# EAGLE design Tapestry (EAGLE 7.3.0)
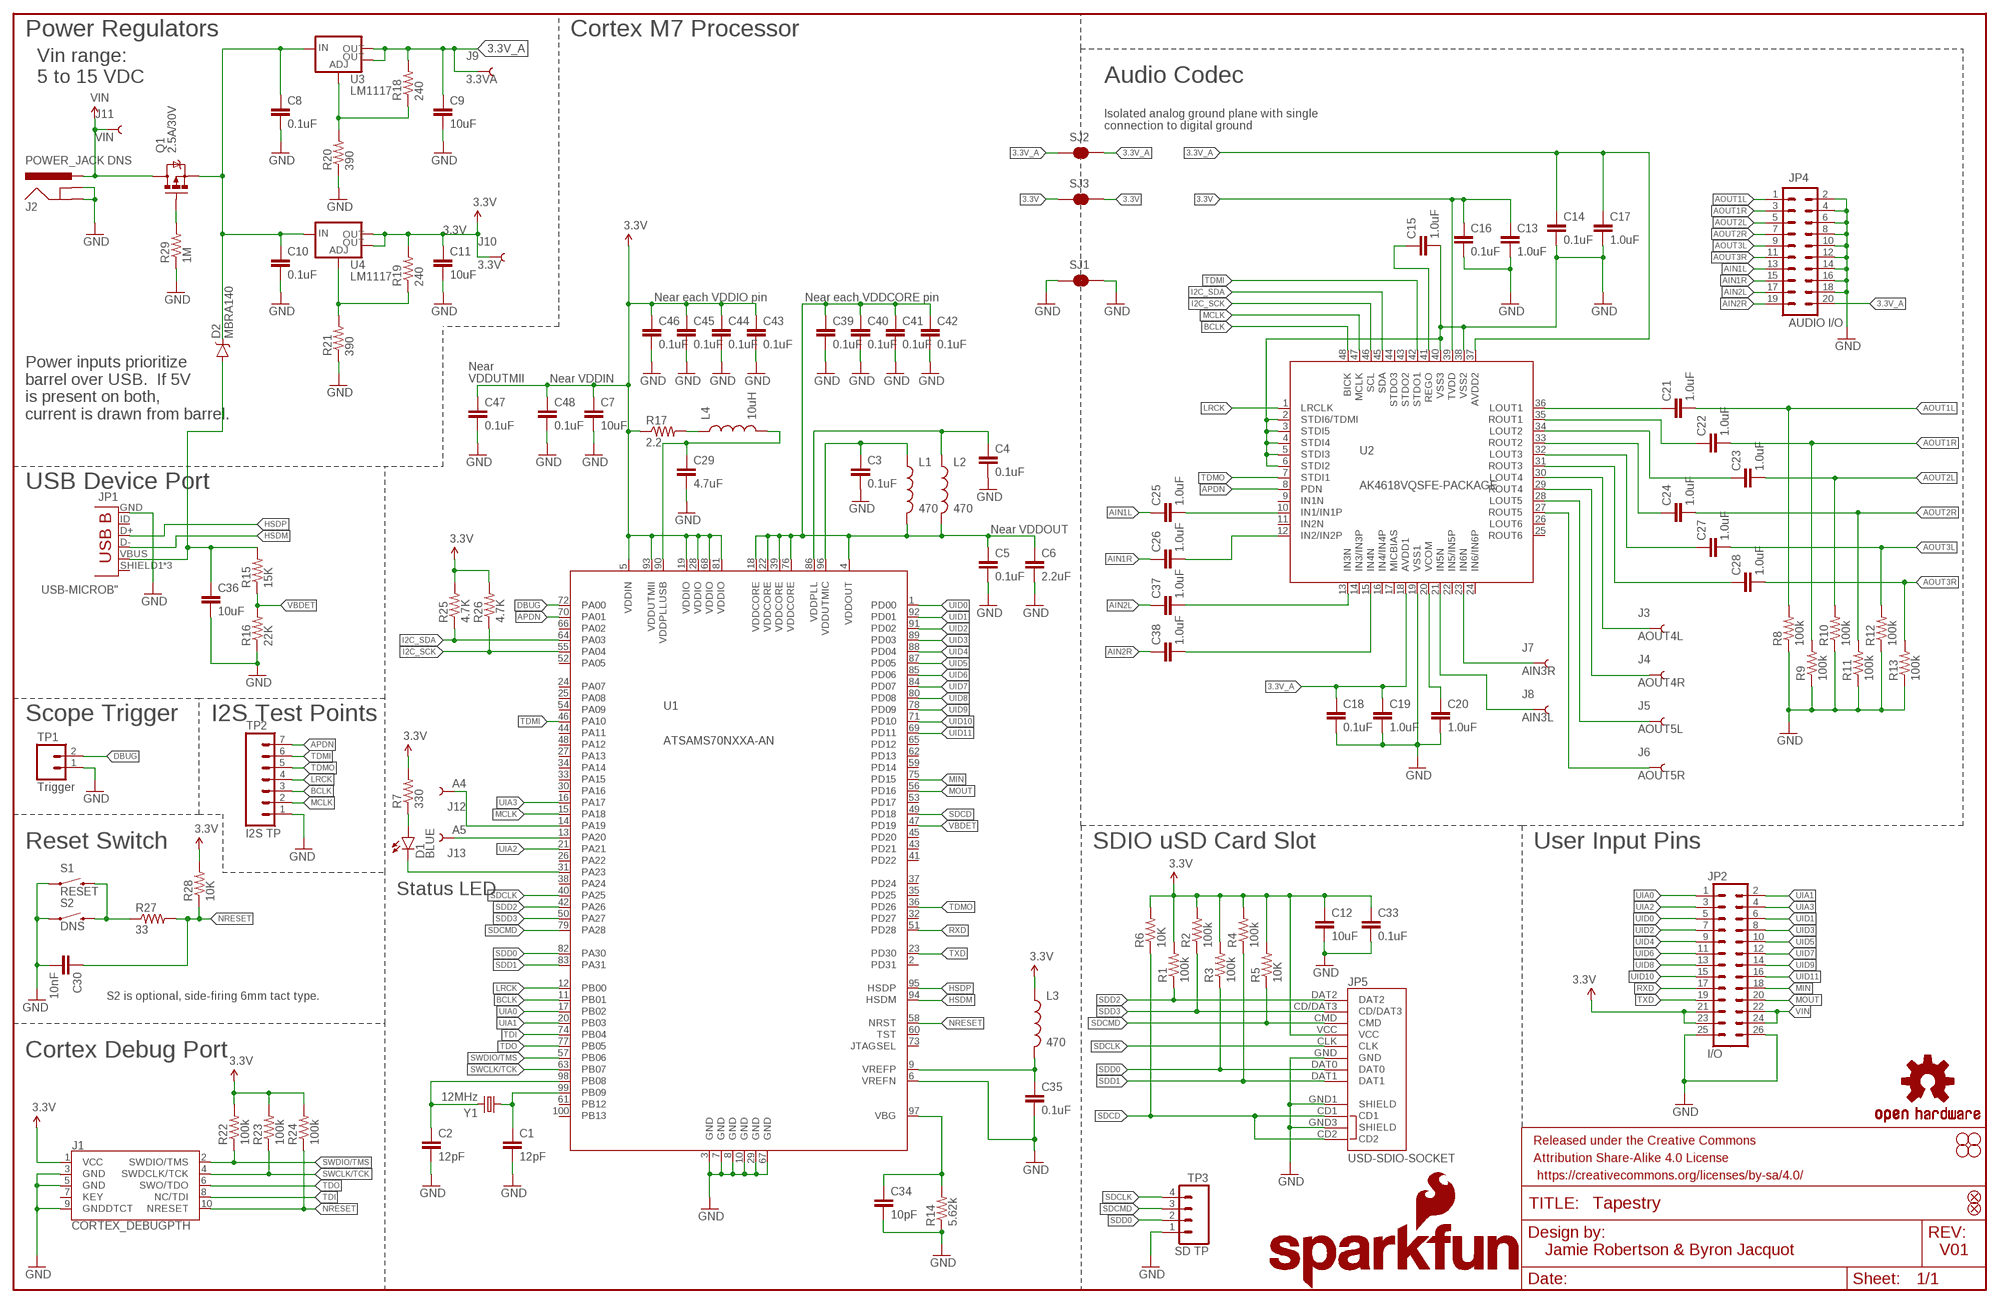
[diagram p0: schematic, sheet 1]

## Parts
C1  12pF  12PF-50V-5%(0603)  [0603-CAP]
C2  12pF  12PF-50V-5%(0603)  [0603-CAP]
C3  0.1uF  0.1UF-25V(+80/-20%)(0603)  [0603-CAP]
C4  0.1uF  0.1UF-25V(+80/-20%)(0603)  [0603-CAP]
C5  0.1uF  0.1UF-25V(+80/-20%)(0603)  [0603-CAP]
C6  2.2uF  2.2UF-10V-20%(0603)  [0603-CAP]
C7  10uF  10UF-6.3V-20%(0603)  [0603-CAP]
C8  0.1uF  0.1UF-25V(+80/-20%)(0603)  [0603-CAP]
C9  10uF  10UF-6.3V-20%(0603)  [0603-CAP]
C10  0.1uF  0.1UF-25V(+80/-20%)(0603)  [0603-CAP]
C11  10uF  10UF-6.3V-20%(0603)  [0603-CAP]
C12  10uF  10UF-6.3V-20%(0603)  [0603-CAP]
C13  1.0uF  1.0UF-16V-10%(0603)  [0603-CAP]
C14  0.1uF  0.1UF-25V(+80/-20%)(0603)  [0603-CAP]
C15  1.0uF  1.0UF-16V-10%(0603)  [0603-CAP]
C16  0.1uF  0.1UF-25V(+80/-20%)(0603)  [0603-CAP]
C17  1.0uF  1.0UF-16V-10%(0603)  [0603-CAP]
C18  0.1uF  0.1UF-25V(+80/-20%)(0603)  [0603-CAP]
C19  1.0uF  1.0UF-16V-10%(0603)  [0603-CAP]
C20  1.0uF  1.0UF-16V-10%(0603)  [0603-CAP]
C21  1.0uF  1.0UF-16V-10%(0603)  [0603-CAP]
C22  1.0uF  1.0UF-16V-10%(0603)  [0603-CAP]
C23  1.0uF  1.0UF-16V-10%(0603)  [0603-CAP]
C24  1.0uF  1.0UF-16V-10%(0603)  [0603-CAP]
C25  1.0uF  1.0UF-16V-10%(0603)  [0603-CAP]
C26  1.0uF  1.0UF-16V-10%(0603)  [0603-CAP]
C27  1.0uF  1.0UF-16V-10%(0603)  [0603-CAP]
C28  1.0uF  1.0UF-16V-10%(0603)  [0603-CAP]
C29  4.7uF  4.7UF-6.3V-10%(0603)0603  [0603-CAP]
C30  10nF  10NF/10000PF-50V-10%(0603)  [0603-CAP]
C33  0.1uF  0.1UF-25V(+80/-20%)(0603)  [0603-CAP]
C34  10pF  10PF-50V-5%(0603)  [0603-CAP]
C35  0.1uF  0.1UF-25V(+80/-20%)(0603)  [0603-CAP]
C36  10uF  10UF-6.3V-20%(0603)  [0603-CAP]
C37  1.0uF  1.0UF-16V-10%(0603)  [0603-CAP]
C38  1.0uF  1.0UF-16V-10%(0603)  [0603-CAP]
C39  0.1uF  0.1UF-25V(+80/-20%)(0603)  [0603-CAP]
C40  0.1uF  0.1UF-25V(+80/-20%)(0603)  [0603-CAP]
C41  0.1uF  0.1UF-25V(+80/-20%)(0603)  [0603-CAP]
C42  0.1uF  0.1UF-25V(+80/-20%)(0603)  [0603-CAP]
C43  0.1uF  0.1UF-25V(+80/-20%)(0603)  [0603-CAP]
C44  0.1uF  0.1UF-25V(+80/-20%)(0603)  [0603-CAP]
C45  0.1uF  0.1UF-25V(+80/-20%)(0603)  [0603-CAP]
C46  0.1uF  0.1UF-25V(+80/-20%)(0603)  [0603-CAP]
C47  0.1uF  0.1UF-25V(+80/-20%)(0603)  [0603-CAP]
C48  0.1uF  0.1UF-25V(+80/-20%)(0603)  [0603-CAP]
D1  BLUE  LED-BLUE0603  [LED-0603]
D2  MBRA140  DIODE-SCHOTTKY-MBRA140  [SMA-DIODE]
FD1  FIDUCIALUFIDUCIAL  [MICRO-FIDUCIAL]
FD2  FIDUCIALUFIDUCIAL  [MICRO-FIDUCIAL]
FRAME1  FRAME-LEDGER  [CREATIVE_COMMONS]
J1  CORTEX_DEBUGPTH  [2X5-PTH-1.27MM]
J2  POWER_JACK DNS  POWER_JACKPTH_LOCK  [POWER_JACK_PTH_LOCK]
J3  AOUT4L  TEST-POINTTP_15TH_THRU  [TP_15TH]
J4  AOUT4R  TEST-POINTTP_15TH_THRU  [TP_15TH]
J5  AOUT5L  TEST-POINTTP_15TH_THRU  [TP_15TH]
J6  AOUT5R  TEST-POINTTP_15TH_THRU  [TP_15TH]
J7  AIN3R  TEST-POINTTP_15TH_THRU  [TP_15TH]
J8  AIN3L  TEST-POINTTP_15TH_THRU  [TP_15TH]
J9  3.3VA  TEST-POINTTP_15TH_THRU  [TP_15TH]
J10  3.3V  TEST-POINTTP_15TH_THRU  [TP_15TH]
J11  VIN  TEST-POINTTP_15TH_THRU  [TP_15TH]
J12  A4  TEST-POINTTP_15TH_THRU  [TP_15TH]
J13  A5  TEST-POINTTP_15TH_THRU  [TP_15TH]
JP1  USB-MICROB"  [USB-B-MICRO-SMD_V03]
JP2  I/O  M13X22X13  [2X13]
JP4  AUDIO I/O  M10X2  [2X10]
JP5  USD-SDIO-SOCKET  [MICRO-SD-SOCKET-SDIO]
L1  470  INDUCTOR0603  [0603]
L2  470  INDUCTOR0603  [0603]
L3  470  INDUCTOR0603  [0603]
L4  10uH  INDUCTOR0805  [0805]
LOGO1  SFE_LOGO_NAME_FLAME.2_INCH  [SFE_LOGO_NAME_FLAME_.2]
LOGO2  OSHW-LOGOM  [OSHW-LOGO-M]
LOGO3  SFE_LOGO_NAME.2_INCH  [SFE_LOGO_NAME_.2]
Q1  2.5A/30V  MOSFET-PCHANNELDMG2307L  [SOT23-3]
R1  100k  100KOHM-1/10W-1%(0603)  [0603-RES]
R2  100k  100KOHM-1/10W-1%(0603)  [0603-RES]
R3  100k  100KOHM-1/10W-1%(0603)  [0603-RES]
R4  100k  100KOHM-1/10W-1%(0603)  [0603-RES]
R5  10K  10KOHM-1/10W-1%(0603)0603  [0603-RES]
R6  10K  10KOHM-1/10W-1%(0603)0603  [0603-RES]
R7  330  330OHM1/10W1%(0603)  [0603-RES]
R8  100k  100KOHM-1/10W-1%(0603)  [0603-RES]
R9  100k  100KOHM-1/10W-1%(0603)  [0603-RES]
R10  100k  100KOHM-1/10W-1%(0603)  [0603-RES]
R11  100k  100KOHM-1/10W-1%(0603)  [0603-RES]
R12  100k  100KOHM-1/10W-1%(0603)  [0603-RES]
R13  100k  100KOHM-1/10W-1%(0603)  [0603-RES]
R14  5.62k  5.62KOHM1/10W1%(0603)  [0603-RES]
R15  15K  15KOHM1/10W1%(0603)0603  [0603-RES]
R16  22K  22KOHM1/10W1%(0603)  [0603-RES]
R17  2.2  2.2OHM-1/10W-5%(0603)  [0603-RES]
R18  240  240OHM1/10W1%(0603)  [0603-RES]
R19  240  240OHM1/10W1%(0603)  [0603-RES]
R20  390  390OHM1/10W1%(0603)  [0603-RES]
R21  390  390OHM1/10W1%(0603)  [0603-RES]
R22  100k  100KOHM-1/10W-1%(0603)  [0603-RES]
R23  100k  100KOHM-1/10W-1%(0603)  [0603-RES]
R24  100k  100KOHM-1/10W-1%(0603)  [0603-RES]
R25  4.7K  4.7KOHM-1/10W-1%(0603)  [0603-RES]
R26  4.7K  4.7KOHM-1/10W-1%(0603)  [0603-RES]
R27  33  33OHM1/10W1%(0603)  [0603-RES]
R28  10K  10KOHM-1/10W-1%(0603)0603  [0603-RES]
R29  1M  1MOHM-1/10W-1%(0603)  [0603-RES]
S1  RESET  SWITCH-MOMENTARY-2SMD  [TACTILE-SWITCH-SMD]
S2  DNS  SWITCH-MOMENTARY-2SIDE_EZ  [TACTILE-PTH-SIDEEZ]
SJ1  JUMPER-PAD-2-NC_BY_TRACE  [PAD-JUMPER-2-NC_BY_TRACE_YES_SILK]
SJ2  JUMPER-PAD-2-NC_BY_TRACE  [PAD-JUMPER-2-NC_BY_TRACE_YES_SILK]
SJ3  JUMPER-PAD-2-NC_BY_TRACE  [PAD-JUMPER-2-NC_BY_TRACE_YES_SILK]
STANDOFF1  STAND-OFF  [STAND-OFF]
STANDOFF2  STAND-OFF  [STAND-OFF]
STANDOFF3  STAND-OFF  [STAND-OFF]
STANDOFF4  STAND-OFF  [STAND-OFF]
TP1  Trigger  M021X02_NO_SILK  [1X02_NO_SILK]
TP2  I2S TP  M07NO_SILK  [1X07_NO_SILK]
TP3  SD TP  M041X04_NO_SILK  [1X04_NO_SILK]
U1  ATSAMS70NXXA-AN  [LQFP100]
U2  AK4618VQSFE-PACKAGE  [LQFP-48]
U3  LM1117  V_REG_LM1117SOT223  [SOT223]
U4  LM1117  V_REG_LM1117SOT223  [SOT223]
Y1  12MHz  CRYSTALCRYSTAL-SMD-5X3-12MHZ  [CRYSTAL-SMD-5X3]

## Nets
3.3V: C7.1 C11.1 C12.1 C13.1 C16.1 C33.1 C43.1 C44.1 C45.1 C46.1 C47.1 C48.1 J1.1(VCC) J10.P$1 JP2.21 JP2.23 JP5.VCC L3.1 R1.2 R2.2 R3.2 R4.2 R5.2 R6.2 R7.2 R17.1 R19.2 R22.2 R23.2 R24.2 R25.2 R26.2 R28.2 SJ3.1 SJ3.2 U1.5(VDDIN) U1.19(VDDIO) U1.28(VDDIO) U1.68(VDDIO) U1.81(VDDIO) U1.93(VDDUTMII) U2.39(TVDD) U4.2(OUT) U4.4(OUT)
3.3V_A: C9.1 C14.1 C17.1 C18.1 C19.1 J9.P$1 JP4.20 R18.2 SJ2.1 SJ2.2 U2.18(AVDD1) U2.37(AVDD2) U3.2(OUT) U3.4(OUT)
AIN1L: C25.1 JP4.13
AIN1R: C26.1 JP4.15
AIN2L: C37.1 JP4.17
AIN2R: C38.1 JP4.19
AOUT1L: C21.2 JP4.1 R8.2
AOUT1R: C22.2 JP4.3 R9.2
AOUT2L: C23.2 JP4.5 R10.2
AOUT2R: C24.2 JP4.7 R11.2
AOUT3L: C27.2 JP4.9 R12.2
AOUT3R: C28.2 JP4.11 R13.2
APDN: TP2.7 U1.70(PA01) U2.8(PDN)
BCLK: TP2.3 U1.11(PB01) U2.48(BICK)
DBUG: TP1.2 U1.72(PA00)
GND: C1.2 C2.2 C3.2 C4.2 C5.2 C6.2 C7.2 C8.2 C9.2 C10.2 C11.2 C12.2 C13.2 C14.2 C15.2 C16.2 C17.2 C18.2 C19.2 C20.2 C29.2 C30.2 C33.2 C34.2 C35.2 C36.2 C39.2 C40.2 C41.2 C42.2 C43.2 C44.2 C45.2 C46.2 C47.2 C48.2 J1.3(GND) J1.5(GND) J1.9(GNDDTCT) J2.GND J2.GNDBREAK JP1.GND JP2.25 JP2.26 JP4.2 JP4.4 JP4.6 JP4.8 JP4.10 JP4.12 JP4.14 JP4.16 JP4.18 JP5.GND JP5.GND1(SHIELD) JP5.GND3(SHIELD) R8.1 R9.1 R10.1 R11.1 R12.1 R13.1 R14.1 R16.1 R20.1 R21.1 R29.1 S1.1 S2.1 SJ1.1 SJ1.2 TP1.1 TP2.1 TP3.1 U1.3(GND) U1.6(VREFN) U1.7(GND) U1.8(GND) U1.10(GND) U1.29(GND) U1.67(GND) U2.2(STDI6/TDMI) U2.3(STDI5) U2.4(STDI4) U2.5(STDI3) U2.6(STDI2) U2.19(VSS1) U2.38(VSS2) U2.40(VSS3)
HSDM: JP1.D- U1.94(HSDM)
HSDP: JP1.D+ U1.95(HSDP)
I2C_SCK: R26.1 U1.55(PA04) U2.46(SCL)
I2C_SDA: R25.1 U1.64(PA03) U2.45(SDA)
LRCK: TP2.4 U1.12(PB00) U2.1(LRCLK)
MCLK: TP2.2 U1.15(PA18) U2.47(MCLK)
MIN: JP2.18 U1.75(PD15)
MOUT: JP2.20 U1.56(PD16)
N$1: C2.1 U1.98(PB08) Y1.3
N$2: C1.1 U1.99(PB09) Y1.1
N$3: C3.1 L1.1 U1.96(VDDUTMIC)
N$4: C29.1 L4.2 U1.90(VDDPLLUSB)
N$5: C4.1 L2.1 U1.86(VDDPLL)
N$6: C15.1 U2.41(REGO)
N$7: C36.1 D2.A JP1.VBUS R15.2
N$9: C8.1 C10.1 D2.C Q1.2(S) U3.3(IN) U4.3(IN)
N$10: D1.C U1.31(PA23)
N$11: D1.A R7.1
N$12: C20.1 U2.20(VCOM)
N$13: C21.1 U2.36(LOUT1)
N$14: C26.2 U2.12(IN2/IN2P)
N$15: C25.2 U2.10(IN1/IN1P)
N$16: C34.1 R14.2 U1.97(VBG)
N$17: C35.1 L3.2 U1.9(VREFP)
N$18: C22.1 U2.35(ROUT1)
N$19: C23.1 U2.34(LOUT2)
N$20: C24.1 U2.33(ROUT2)
N$21: C27.1 U2.32(LOUT3)
N$22: C28.1 U2.31(ROUT3)
N$23: C37.2 U2.13(IN3N)
N$24: L4.1 R17.2
N$25: R18.1 R20.2 U3.1(ADJ)
N$26: R27.1 S1.3 S2.2
N$27: C38.2 U2.15(IN4N)
N$28: J7.P$1 U2.23(IN6N)
N$29: R19.1 R21.2 U4.1(ADJ)
N$30: J8.P$1 U2.21(IN5N)
N$31: J3.P$1 U2.30(LOUT4)
N$32: J4.P$1 U2.29(ROUT4)
N$33: J5.P$1 U2.28(LOUT5)
N$34: J6.P$1 U2.27(ROUT5)
N$35: J12.P$1 U1.14(PA19)
N$36: J13.P$1 U1.13(PA20)
N$75: Q1.1(G) R29.2
NRESET: C30.1 J1.10(NRESET) R24.1 R27.2 R28.1 U1.58(NRST)
RXD: JP2.17 U1.51(PD28)
SDCD: JP5.CD1 JP5.CD2 R6.1 U1.49(PD18)
SDCLK: JP5.CLK TP3.4 U1.40(PA25)
SDCMD: JP5.CMD R5.1 TP3.3 U1.79(PA28)
SDD0: JP5.DAT0 R3.1 TP3.2 U1.82(PA30)
SDD1: JP5.DAT1 R4.1 U1.83(PA31)
SDD2: JP5.DAT2 R1.1 U1.42(PA26)
SDD3: JP5.CD/DAT3 R2.1 U1.50(PA27)
SWCLK/TCK: J1.4(SWDCLK/TCK) R23.1 U1.63(PB07)
SWDIO/TMS: J1.2(SWDIO/TMS) R22.1 U1.57(PB06)
TDI: J1.8(NC/TDI) U1.74(PB04)
TDMI: TP2.6 U1.46(PA10) U2.42(STDO1)
TDMO: TP2.5 U1.36(PD26) U2.7(STDI1)
TDO: J1.6(SWO/TDO) U1.77(PB05)
TXD: JP2.19 U1.23(PD30)
UIA0: JP2.1 U1.17(PB02)
UIA1: JP2.2 U1.20(PB03)
UIA2: JP2.3 U1.21(PA21)
UIA3: JP2.4 U1.16(PA17)
UID0: JP2.5 U1.1(PD00)
UID1: JP2.6 U1.92(PD01)
UID2: JP2.7 U1.91(PD02)
UID3: JP2.8 U1.89(PD03)
UID4: JP2.9 U1.88(PD04)
UID5: JP2.10 U1.87(PD05)
UID6: JP2.11 U1.85(PD06)
UID7: JP2.12 U1.84(PD07)
UID8: JP2.13 U1.80(PD08)
UID9: JP2.14 U1.78(PD09)
UID10: JP2.15 U1.71(PD10)
UID11: JP2.16 U1.69(PD11)
VBDET: R15.1 R16.2 U1.47(PD19)
VDDOUT: C5.1 C6.1 C39.1 C40.1 C41.1 C42.1 L1.2 L2.2 U1.4(VDDOUT) U1.18(VDDCORE) U1.22(VDDCORE) U1.39(VDDCORE) U1.76(VDDCORE)
VIN: J2.PWR J11.P$1 JP2.22 JP2.24 Q1.3(D)
Unconnected: J1.7(KEY) JP1.ID(USBID) JP1.SHIELD1(SHIELD) JP1.SHIELD2(SHIELD) JP1.SHIELD3(SHIELD) U1.2(PD31) U1.24(PA07) U1.25(PA08) U1.26(PA22) U1.27(PA13) U1.30(PA16) U1.32(PD27) U1.33(PA15) U1.34(PA14) U1.35(PD25) U1.37(PD24) U1.38(PA24) U1.41(PD22) U1.43(PD21) U1.44(PA11) U1.45(PD20) U1.48(PA12) U1.52(PA05) U1.53(PD17) U1.54(PA09) U1.59(PD14) U1.60(TST) U1.61(PB12) U1.62(PD13) U1.65(PD12) U1.66(PA02) U1.73(JTAGSEL) U1.100(PB13) U2.9(IN1N) U2.11(IN2N) U2.14(IN3/IN3P) U2.16(IN4/IN4P) U2.17(MICBIAS) U2.22(IN5/IN5P) U2.24(IN6/IN6P) U2.25(ROUT6) U2.26(LOUT6) U2.43(STDO2) U2.44(STDO3)

## Notes on the sheet
- Power Regulators | Cortex M7 Processor
- Vin range:
  5 to 15 VDC
- Audio Codec
- Isolated analog ground plane with single
  connection to digital ground
- Near each VDDIO pin | Near each VDDCORE pin
- Near
  VDDUTMII
- Near VDDIN
- Power inputs prioritize 
  barrel over USB.  If 5V 
  is present on both, 
  current is drawn from barrel.
- USB Device Port
- Near VDDOUT
- Scope Trigger | I2S Test Points
- Reset Switch | SDIO uSD Card Slot | User Input Pins
- Status LED
- S2 is optional, side-firing 6mm tact type.
- Cortex Debug Port
- Jamie Robertson & Byron Jacquot | V01

## Library data of the parts
C1 C2 = SparkFun-Capacitors:12PF-50V-5%(0603): CAP-09137; PROD_ID: CAP-09137
C3-C5 C8 C10 C14 C16 C18 C33 C35 C39-C48 = SparkFun-Capacitors:0.1UF-25V(+80/-20%)(0603): CAP-00810 Ceramic Standard decoupling cap; PROD_ID: CAP-00810
C6 = SparkFun-Capacitors:2.2UF-10V-20%(0603): CAP-07888; PROD_ID: CAP-07888
C7 C9 C11 C12 C36 = SparkFun-Capacitors:10UF-6.3V-20%(0603): CAP-11015; PROD_ID: CAP-11015
C13 C15 C17 C19-C28 C37 C38 = SparkFun-Capacitors:1.0UF-16V-10%(0603): CAP-00868; PROD_ID: CAP-00868
C29 = SparkFun-Capacitors:4.7UF-6.3V-10%(0603): CAP-08280; PROD_ID: CAP-08280
C30 = SparkFun-Capacitors:10NF/10000PF-50V-10%(0603): CAP-00867; PROD_ID: CAP-00867
C34 = SparkFun-Capacitors:10PF-50V-5%(0603): CAP-11812; PROD_ID: CAP-11812
D1 = SparkFun-LED:LED-BLUE: Blue LEDs for production use Various blue LEDs stocked by SparkFun production 0603 - DIO-08575 Rebel - DIO-09553 1206 - DIO-09911; PROD_ID: DIO-08575
D2 = SparkFun-DiscreteSemi:DIODE-SCHOTTKY: Schottky diodes in SFE's production catalog BAT20J 1A 23V 0.62Vf RB751 120mA 40V 0.37Vf PMEG4005EJ 0.5A 40V 0.42Vf MBRA140 1A 40V 0.5Vf B340A 3A 40V SMA; PROD_ID: DIO-08053
FD1 FD2 = SparkFun-Aesthetics:FIDUCIAL: Fiducial Alignment Points Various fiducial points for machine vision alignment.
FRAME1 = SparkFun-Aesthetics:FRAME-LEDGER: Schematic Frame Standard 11x14 US Ledger frame
J1 = SparkFun-Connectors:CORTEX_DEBUG: Cortex Debug Connector Datasheet <http://infocenter.arm.com/help/topic/com.arm.doc.faqs/attached/13634/cortex_debug_connectors.pdf>
J2 = SparkFun-Connectors:POWER_JACK: Power Jack This is the standard 5.5mm barrel jack for power. The PTH is the most common, proven, reliable, footprint. The Slot footprint only works if the mill layer is transmitted to the PCB fab house so be warned. Mating wall wart : TOL-00298 (and others); PROD_ID: CONN-08197; SF_ID: PRT-00119
J3-J13 = SparkFun-Passives:TEST-POINT: Bare copper test points for troubleshooting or ICT
JP1 = SparkFun-Connectors:USB-MICROB; PROD_ID: CONN-11752
JP2 = SparkFun-Connectors:M13X2: 0.1" spaced headers
JP4 = SparkFun-Connectors:M10X2: This was SPECIALLY designed to be used with our Graphic LCD Backpack. Be sure you want to use this! It is not only staggered on each line of header holes, but IT IS ALSO offset of the center point of the top and bottom lines by 5 mil. This causes the headers to lock into place on the "standard" footprint on the LCD screen. The extra squares on the tdocu layer are there simply to reference other pins (if you were to actually populate a longer header than ten long - this is what we do with the backpacks).
JP5 = SparkFun-Connectors:USD-SDIO-SOCKET: microSD Socket Push-push type uSD socket with full SDIO signal mapping. Spark Fun Electronics SKU : PRT-00127. tDoc lines correctly indicate media card edge positions when inserting (unlocked, locked, depressed). NOTE: CD1 and CD2 are connected internally, and short to ground when card is removed.; PROD_ID: CONN-07820
L1-L3 = SparkFun-Passives:INDUCTOR: Inductors Basic Inductor/Choke - 0603 and 1206. Footprints are not proven and vary greatly between part numbers. INDUCTOR POWER 3.3UH 4.0A SMD 0.197" L x 0.197" W x 0.177" H (5.00mm x 5.00mm x 4.50mm); PROD_ID: NDUC-12579
L4 = SparkFun-Passives:INDUCTOR: Inductors Basic Inductor/Choke - 0603 and 1206. Footprints are not proven and vary greatly between part numbers. INDUCTOR POWER 3.3UH 4.0A SMD 0.197" L x 0.197" W x 0.177" H (5.00mm x 5.00mm x 4.50mm); PROD_ID: NDUC-13231
LOGO1 = SparkFun-Aesthetics:SFE_LOGO_NAME_FLAME: SFE Logo, name and flame This is the SparkFun full logo. The logo on the schematic will always be the same size; the package variant is the height of the flame part of the logo. Default layer for the logo on the board is tSilk.
LOGO2 = SparkFun-Aesthetics:OSHW-LOGO: Open Source Hardware Logo This logo indicates the piece of hardware it is found on incorporates a OSHW license and/or adheres to the definition of open source hardware found here: http://freedomdefined.org/OSHW
LOGO3 = SparkFun-Aesthetics:SFE_LOGO_NAME: SFE Logo, name only This is the SparkFun name logo. The logo on the schematic will always be the same size; the package variant is the height of the flame part of the logo (or the height the flame would be, if it were drawn). Default layer for the logo on the board is tSilk.
Q1 = SparkFun-DiscreteSemi:MOSFET-PCHANNEL: Generic PMOSFET IRLML2244 - TRANS-11153 (SOT-23 -20V -4.3A) (1.Gate 2.Source 3.Drain) FQP27P06 - COM-10349 <http://www.sparkfun.com/products/10349> (TO-220 -60V -27A) (1.Gate 2.Source 3.Drain); PROD_ID: TRANS-11308
R1-R4 R8-R13 R22-R24 = SparkFun-Resistors:100KOHM-1/10W-1%(0603): RES-07828; PROD_ID: RES-07828
R5 R6 R28 = SparkFun-Resistors:10KOHM-1/10W-1%(0603): RES-00824; PROD_ID: RES-00824
R7 = SparkFun-Resistors:330OHM1/10W1%(0603): RES-00818; PROD_ID: RES-00818
R14 = SparkFun-Resistors:5.62KOHM1/10W1%(0603): RES-09823; PROD_ID: RES-09823
R15 = SparkFun-Resistors:15KOHM1/10W1%(0603): RES-07854; PROD_ID: RES-07854
R16 = SparkFun-Resistors:22KOHM1/10W1%(0603): RES-07853; PROD_ID: RES-07853
R17 = SparkFun-Resistors:2.2OHM-1/10W-5%(0603): RES-07823; PROD_ID: RES-07823
R18 R19 = SparkFun-Resistors:240OHM1/10W1%(0603): RES-07849; PROD_ID: RES-07849
R20 R21 = SparkFun-Resistors:390OHM1/10W1%(0603): RES-07864; PROD_ID: RES-07864
R25 R26 = SparkFun-Resistors:4.7KOHM-1/10W-1%(0603): RES-07857; PROD_ID: RES-07857
R27 = SparkFun-Resistors:33OHM1/10W1%(0603): RES-08270; PROD_ID: RES-08270
R29 = SparkFun-Resistors:1MOHM-1/10W-1%(0603): RES-07868; PROD_ID: RES-07868
S1 = SparkFun-Electromechanical:SWITCH-MOMENTARY-2: Various NO switches- pushbuttons, reed, etc; PROD_ID: SWCH-08247
S2 = SparkFun-Electromechanical:SWITCH-MOMENTARY-2: Various NO switches- pushbuttons, reed, etc
SJ1-SJ3 = SparkFun-Passives:JUMPER-PAD-2-NC_BY_TRACE
STANDOFF1-STANDOFF4 = SparkFun-Electromechanical:STAND-OFF: #4 Stand Off This is the mechanical footprint for a #4 phillips button head screw. Use the keepout ring to avoid running the screw head into surrounding components. SKU : PRT-00447
TP1 = SparkFun-Connectors:M02: Standard 2-pin 0.1" header. Use with - straight break away headers ( PRT-00116) - right angle break away headers (PRT-00553) - swiss pins (PRT-00743) - machine pins (PRT-00117) - female headers (PRT-00115) Molex polarized connector foot print use with: PRT-08233 with associated crimp pins and housings. 2.54_SCREWTERM for use with PRT-10571. 3.5mm Screw Terminal footprints for PRT-08084 5mm Screw Terminal footprints for use with PRT-08432
TP2 = SparkFun-Connectors:M07: Header 7 Standard 7-pin 0.1" header. Use with straight break away headers (SKU : PRT-00116), right angle break away headers (PRT-00553), swiss pins (PRT-00743), machine pins (PRT-00117), and female headers (PRT-00115). NOTES ON THE VARIANTS LOCK and LOCK_LONGPADS... This footprint was designed to help hold the alignment of a through-hole component (i.e. 7-pin header) while soldering it into place. You may notice that each hole has been shifted either up or down by 0.005 of an inch from it's more standard position (which is usually a perfectly straight line). This slight alteration caused the pins (the squares in the middle) to touch the edges of the holes. Because they are alternating, it causes a "brace" to hold the header in place. 0.005 has proven to be the perfect amount of "off-center" position when using our standard breakaway headers. Although looks a little odd when you look at the bare footprint, once you have a header in there, the alteration is very hard to notice. Also, if you push a header all the way into place, it is covered up entirely on the bottom side. This idea of altering the position of holes to aid alignment will be further integrated into the Sparkfun Library for other footprints. It can help hold any component with 3 or more connection pins.
TP3 = SparkFun-Connectors:M04: Header 4 Standard 4-pin 0.1" header. Use with straight break away headers (SKU : PRT-00116), right angle break away headers (PRT-00553), swiss pins (PRT-00743), machine pins (PRT-00117), and female headers (PRT-00115). Molex polarized connector foot print use with SKU : PRT-08231 with associated crimp pins and housings. 1MM SMD Version SKU: PRT-10208; PROD_ID: CONN-09696
U1 = tapestry:ATSAMS70NXXA-AN; PROD_ID: IC-13238
U2 = tapestry:AK4618VQ; PROD_ID: IC-13239
U3 U4 = SparkFun-PowerIC:V_REG_LM1117: Voltage Regulator LM1117 Standard adjustable voltage regulator but in SMD form. Spark Fun Electronics SKU : COM-00595; PROD_ID: VREG-08170
Y1 = SparkFun-FreqCtrl:CRYSTAL: Various standard crystals. Proven footprints.; PROD_ID: XTAL-08297

## Board
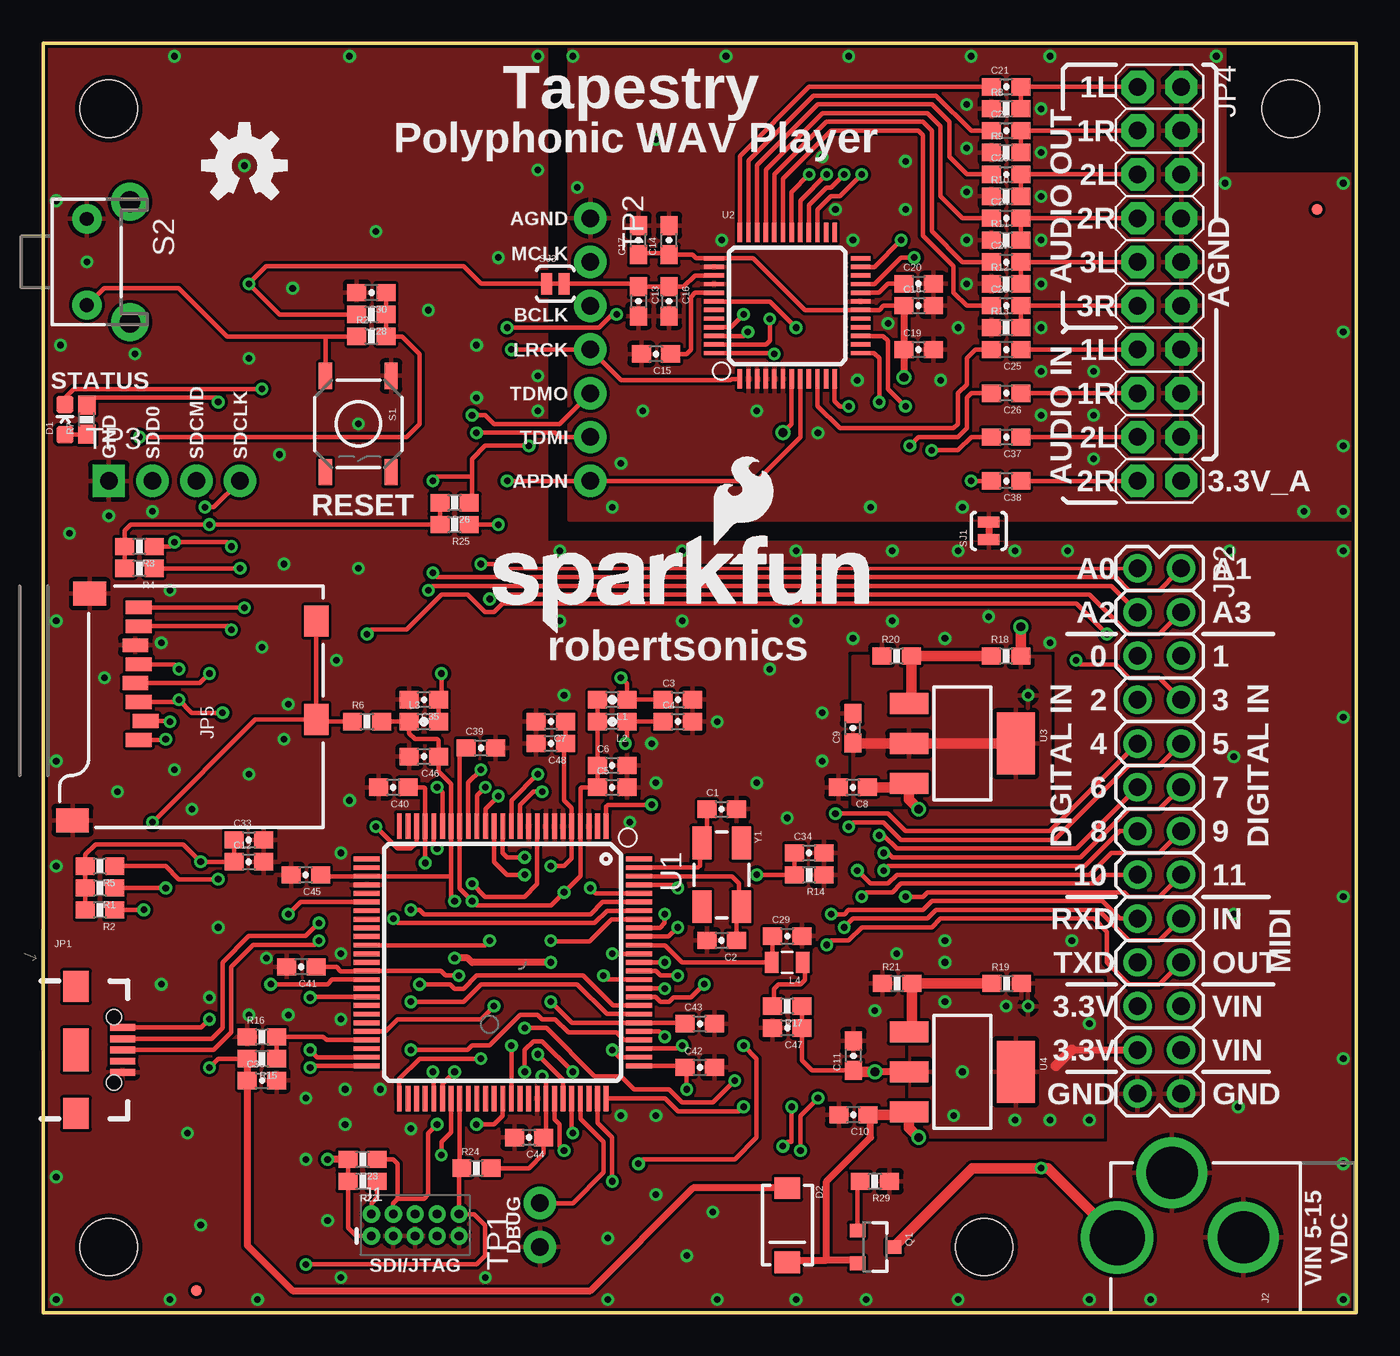
[diagram p1: board, top side]
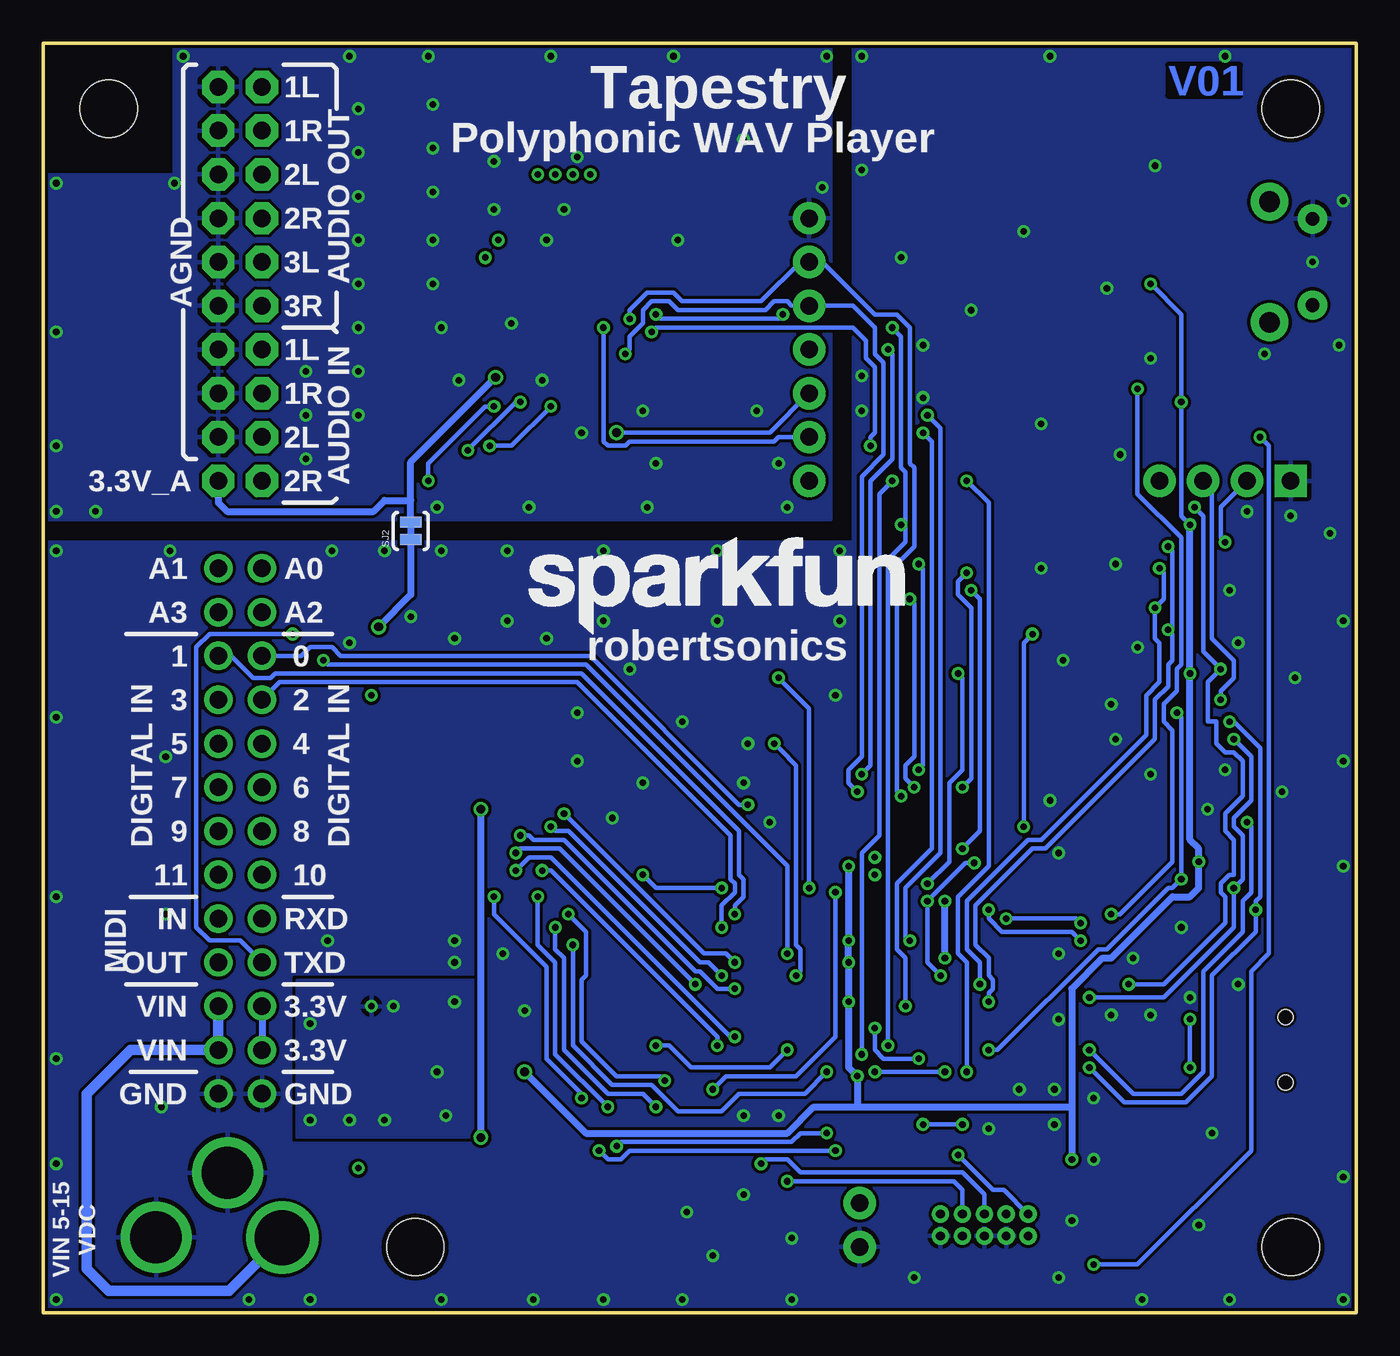
[diagram p2: board, bottom side, seen from below]

Size 76.2 x 73.66 mm. Coordinates in mm from the lower left corner, seen from the top.
Outline: 0,0 76.2,0 76.2,73.66 0,73.66 0,0
Copper layers (1*16): Top 0.035mm / dielectric 1.5mm / Bottom 0.035mm
Design rules "SparkFun-2-layer-TIGHT": minimum track width 7mil, minimum drill 15mil, track to track 7mil, track to pad 7mil, pad to pad 7mil, via to via 7mil, smd to smd 7mil, copper to edge 7mil, drill to drill 7mil, minimum pad ring 7mil, minimum via ring 7mil, stop-mask expansion 4mil, vias tented up to drill 20mil, thermal gap 10mil
tRestrict: area 41.1,53.7 to 41.3,54.5; area 41.7,53.7 to 41.8,54.5; area 42.2,53.7 to 42.3,54.5; area 42.7,53.7 to 42.8,54.5; area 29.3,27.8 to 29.5,28.6; area 29.8,27.8 to 30,28.6

### Footprints (pad centres in the part's own frame; a part is rotated, then mirrored left to right if it is on the bottom)
0603-CAP = smd 1.1 x 1: 1 -0.85,0; 2 0.85,0
LED-0603 = smd 1 x 1: A 0,-0.877; C 0,0.877
SMA-DIODE = smd 1.27 x 1.47: A -2.15,0; C 2.15,0
MICRO-FIDUCIAL = smd 0.635 x 0.635: 1 0,0
2X5-PTH-1.27MM = drill 0.508 pad 1: 1 -2.54,-0.635; 2 -2.54,0.635; 3 -1.27,-0.635; 4 -1.27,0.635; 5 0,-0.635; 6 0,0.635; 7 1.27,-0.635; 8 1.27,0.635; 9 2.54,-0.635; 10 2.54,0.635
POWER_JACK_PTH_LOCK = drill 2.997 pad 4.115: GND 0.025,6.557; GNDBREAK 3.762,10.7 | drill 3.2 pad 4.115: PWR 0,13.878
TP_15TH = drill 0.381 pad 0.61: P$1 0,0
USB-B-MICRO-SMD_V03 = smd 1.45 x 0.4: D+ 2.725,0; D- 2.725,0.65; GND 2.725,-1.3; ID 2.725,-0.65; VBUS 2.725,1.3 | smd 1.5 x 1.8: SHIELD1 0,3.685; SHIELD2 0,-3.685 | smd 1.5 x 2.5: SHIELD3 0,0 | hole 0.85: 2.2,1.9; 2.2,-1.9
2X13 = drill 1.016 pad 1.651: 1 0,0; 2 0,2.54; 3 2.54,0; 4 2.54,2.54; 5 5.08,0; 6 5.08,2.54; 7 7.62,0; 8 7.62,2.54; 9 10.16,0; 10 10.16,2.54; 11 12.7,0; 12 12.7,2.54; 13 15.24,0; 14 15.24,2.54; 15 17.78,0; 16 17.78,2.54; 17 20.32,0; 18 20.32,2.54; 19 22.86,0; 20 22.86,2.54; 21 25.4,0; 22 25.4,2.54; 23 27.94,0; 24 27.94,2.54; 25 30.48,0; 26 30.48,2.54
2X10 = drill 1.016 pad 1.88 octagon: 1 -11.43,-1.27; 2 -11.43,1.27; 3 -8.89,-1.27; 4 -8.89,1.27; 5 -6.35,-1.27; 6 -6.35,1.27; 7 -3.81,-1.27; 8 -3.81,1.27; 9 -1.27,-1.27; 10 -1.27,1.27; 11 1.27,-1.27; 12 1.27,1.27; 13 3.81,-1.27; 14 3.81,1.27; 15 6.35,-1.27; 16 6.35,1.27; 17 8.89,-1.27; 18 8.89,1.27; 19 11.43,-1.27; 20 11.43,1.27
MICRO-SD-SOCKET-SDIO = smd 1.8 x 1.4: CD1 11.92,0.4; CD2 6.22,0.4 | smd 0.8 x 1.5: CD/DAT3 6.13,10.3; CLK 9.43,10.7; CMD 7.23,10.7; DAT0 11.63,10.7; DAT1 12.73,10.7; DAT2 5.03,10.7; GND 10.53,10.9; VCC 8.33,10.9 | smd 1.4 x 1.9: GND1 0.37,14.55; GND3 13.52,13.55
0603 = smd 1.1 x 1: 1 -0.85,0; 2 0.85,0
0805 = smd 0.8 x 1.2: 1 -0.9,0; 2 0.9,0
SOT23-3 = smd 0.8 x 0.9: 1 -0.95,-1; 2 0.95,-1; 3 0,1.1
0603-RES = smd 1.1 x 1: 1 -0.85,0; 2 0.85,0
TACTILE-SWITCH-SMD = smd 1.524 x 0.762: 1 -2.794,1.905; 2 2.794,1.905; 3 -2.794,-1.905; 4 2.794,-1.905
TACTILE-PTH-SIDEEZ = drill 0.8 pad 1.7: 1 -2.5,0; 2 2.5,0 | drill 1.2 pad 2.2: ANCHOR1 -3.5,2.5; ANCHOR2 3.5,2.5
PAD-JUMPER-2-NC_BY_TRACE_YES_SILK = smd 0.635 x 1.27: 1 -0.508,0; 2 0.508,0
STAND-OFF = hole 3.302: 0,0
1X02_NO_SILK = drill 1.016 pad 1.88: 1 0,0; 2 2.54,0
1X07_NO_SILK = drill 1.016 pad 1.88: 1 0,0; 2 2.54,0; 3 5.08,0; 4 7.62,0; 5 10.16,0; 6 12.7,0; 7 15.24,0
1X04_NO_SILK = drill 1.016 pad 1.88 square: 1 0,0 | drill 1.016 pad 1.88: 2 2.54,0; 3 5.08,0; 4 7.62,0
LQFP100 = smd 1.5 x 0.28: 1 -7.9,6; 2 -7.9,5.5; 3 -7.9,5; 4 -7.9,4.5; 5 -7.9,4; 6 -7.9,3.5; 7 -7.9,3; 8 -7.9,2.5; 9 -7.9,2; 10 -7.9,1.5; 11 -7.9,1; 12 -7.9,0.5; 13 -7.9,0; 14 -7.9,-0.5; 15 -7.9,-1; 16 -7.9,-1.5; 17 -7.9,-2; 18 -7.9,-2.5; 19 -7.9,-3; 20 -7.9,-3.5; 21 -7.9,-4; 22 -7.9,-4.5; 23 -7.9,-5; 24 -7.9,-5.5; 25 -7.9,-6; 51 7.9,-6; 52 7.9,-5.5; 53 7.9,-5; 54 7.9,-4.5; 55 7.9,-4; 56 7.9,-3.5; 57 7.9,-3; 58 7.9,-2.5; 59 7.9,-2; 60 7.9,-1.5; 61 7.9,-1; 62 7.9,-0.5; 63 7.9,0; 64 7.9,0.5; 65 7.9,1; 66 7.9,1.5; 67 7.9,2; 68 7.9,2.5; 69 7.9,3; 70 7.9,3.5; 71 7.9,4; 72 7.9,4.5; 73 7.9,5; 74 7.9,5.5; 75 7.9,6 | smd 0.28 x 1.5: 26 -6,-7.9; 27 -5.5,-7.9; 28 -5,-7.9; 29 -4.5,-7.9; 30 -4,-7.9; 31 -3.5,-7.9; 32 -3,-7.9; 33 -2.5,-7.9; 34 -2,-7.9; 35 -1.5,-7.9; 36 -1,-7.9; 37 -0.5,-7.9; 38 0,-7.9; 39 0.5,-7.9; 40 1,-7.9; 41 1.5,-7.9; 42 2,-7.9; 43 2.5,-7.9; 44 3,-7.9; 45 3.5,-7.9; 46 4,-7.9; 47 4.5,-7.9; 48 5,-7.9; 49 5.5,-7.9; 50 6,-7.9; 76 6,7.9; 77 5.5,7.9; 78 5,7.9; 79 4.5,7.9; 80 4,7.9; 81 3.5,7.9; 82 3,7.9; 83 2.5,7.9; 84 2,7.9; 85 1.5,7.9; 86 1,7.9; 87 0.5,7.9; 88 0,7.9; 89 -0.5,7.9; 90 -1,7.9; 91 -1.5,7.9; 92 -2,7.9; 93 -2.5,7.9; 94 -3,7.9; 95 -3.5,7.9; 96 -4,7.9; 97 -4.5,7.9; 98 -5,7.9; 99 -5.5,7.9; 100 -6,7.9
LQFP-48 = smd 0.254 x 1.143: 1 -2.75,-4.25; 2 -2.25,-4.25; 3 -1.75,-4.25; 4 -1.25,-4.25; 5 -0.75,-4.25; 6 -0.25,-4.25; 7 0.25,-4.25; 8 0.75,-4.25; 9 1.25,-4.25; 10 1.75,-4.25; 11 2.25,-4.25; 12 2.75,-4.25; 25 2.75,4.25; 26 2.25,4.25; 27 1.75,4.25; 28 1.25,4.25; 29 0.75,4.25; 30 0.25,4.25; 31 -0.25,4.25; 32 -0.75,4.25; 33 -1.25,4.25; 34 -1.75,4.25; 35 -2.25,4.25; 36 -2.75,4.25 | smd 1.143 x 0.254: 13 4.25,-2.75; 14 4.25,-2.25; 15 4.25,-1.75; 16 4.25,-1.25; 17 4.25,-0.75; 18 4.25,-0.25; 19 4.25,0.25; 20 4.25,0.75; 21 4.25,1.25; 22 4.25,1.75; 23 4.25,2.25; 24 4.25,2.75; 37 -4.25,2.75; 38 -4.25,2.25; 39 -4.25,1.75; 40 -4.25,1.25; 41 -4.25,0.75; 42 -4.25,0.25; 43 -4.25,-0.25; 44 -4.25,-0.75; 45 -4.25,-1.25; 46 -4.25,-1.75; 47 -4.25,-2.25; 48 -4.25,-2.75
SOT223 = smd 1.219 x 2.235: 1 -2.311,-3.099; 2 0,-3.099; 3 2.311,-3.099 | smd 3.6 x 2.2: 4 0,3.099
CRYSTAL-SMD-5X3 = smd 1.9 x 1.1: 1 -1.85,-1.15; 2 1.85,-1.15; 3 1.85,1.15; 4 -1.85,1.15

### Placement (x,y rotation side)
C1  39.37,29.21 0 top
C2  39.37,21.59 180 top
C3  36.83,35.56 0 top
C4  36.83,34.29 0 top
C5  33.02,30.48 0 top
C6  33.02,31.75 0 top
C7  29.46,34.29 180 top
C8  46.99,30.48 180 top
C9  46.99,33.91 90 top
C10  47.02,11.48 180 top
C11  47.02,14.91 90 top
C12  11.94,26.16 0 top
C13  34.54,58.67 270 top
C14  36.32,62.23 90 top
C15  35.56,55.63 180 top
C16  36.32,58.67 270 top
C17  34.54,62.23 90 top
C18  50.8,58.42 0 top
C19  50.8,55.88 0 top
C20  50.8,59.69 0 top
C21  55.88,71.12 0 top
C22  55.88,68.58 0 top
C23  55.88,66.04 0 top
C24  55.88,63.5 0 top
C25  55.88,55.88 180 top
C26  55.88,53.34 180 top
C27  55.88,60.96 0 top
C28  55.88,58.42 0 top
C29  43.18,21.84 0 top
C30  19.05,59.18 180 top
C33  11.94,27.43 0 top
C34  44.45,26.67 0 top
C35  22.1,35.56 180 top
C36  12.7,13.46 0 top
C37  55.88,50.8 180 top
C38  55.88,48.26 180 top
C39  25.4,32.77 0 top
C40  20.32,30.48 180 top
C41  14.99,20.07 180 top
C42  38.1,14.22 0 top
C43  38.1,16.76 0 top
C44  28.19,10.16 180 top
C45  15.24,25.4 180 top
C46  22.1,32.26 180 top
C47  43.18,16.51 180 top
C48  29.46,33.02 180 top
D1  1.27,51.82 0 top
D2  43.18,5.08 270 top
FD1  8.89,1.27 0 top
FD2  73.91,64.01 0 top
FRAME1  -1.27,-31.75 0 top  (outside the outline)
J1  21.59,5.08 0 top
J2  POWER_JACK  [POWER_JACK_PTH_LOCK]  76.2,4.35 90 top
J3  44.45,66.04 90 top
J4  45.47,66.04 90 top
J5  46.48,66.04 90 top
J6  47.5,66.04 90 top
J7  49.78,62.23 90 top
J8  50.55,61.21 90 top
J9  57.15,35.81 0 top
J10  57.15,17.78 0 top
J11  57.91,8.38 0 top
J12  27.94,25.4 0 top
J13  27.94,26.42 0 top
JP1  1.91,15.24 0 top
JP2  63.5,43.18 270 top
JP4  64.77,59.69 270 top
JP5  16.26,28.19 90 top
L1  33.02,35.56 180 top
L2  33.02,34.29 180 top
L3  22.1,34.29 0 top
L4  43.18,20.32 180 top
LOGO1  25.4,39.37 0 top
LOGO2  11.68,66.55 0 top
LOGO3  48.01,39.37 0 bottom
Q1  48.26,3.81 270 top
R1  3.3,24.64 180 top
R2  3.3,23.37 180 top
R3  5.59,44.45 180 top
R4  5.59,43.18 180 top
R5  3.3,25.91 180 top
R6  18.8,34.29 0 top
R7  2.54,51.82 90 top
R8  55.88,69.85 0 top
R9  55.88,67.31 0 top
R10  55.88,64.77 0 top
R11  55.88,62.23 0 top
R12  55.88,59.69 0 top
R13  55.88,57.15 0 top
R14  44.45,25.4 180 top
R15  12.7,14.73 180 top
R16  12.7,16 0 top
R17  43.18,17.78 180 top
R18  55.88,38.1 0 top
R19  55.91,19.1 0 top
R20  49.53,38.1 0 top
R21  49.56,19.1 0 top
R22  18.54,7.62 180 top
R23  18.54,8.89 180 top
R24  25.15,8.38 0 top
R25  23.88,45.72 180 top
R26  23.88,46.99 180 top
R27  19.05,56.64 0 top
R28  19.05,57.91 180 top
R29  48.26,7.62 180 top
S1  18.29,51.56 270 top
S2  2.54,60.96 270 top
SJ1  54.86,45.35 90 top
SJ2  54.86,45.35 90 bottom
SJ3  29.72,59.69 0 top
STANDOFF1  3.81,3.81 0 top
STANDOFF2  3.81,69.85 0 top
STANDOFF3  54.61,3.81 0 top
STANDOFF4  72.39,69.85 0 top
TP1  28.83,3.81 90 top
TP2  31.75,63.5 270 top
TP3  3.81,48.26 0 top
U1  26.67,20.32 270 top
U2  43.18,58.42 0 top
U3  53.34,33.02 270 top
U4  53.34,13.97 270 top
Y1  39.37,25.4 270 top

### Tracks (layer width: path | path; a pad name or v marks a point on that pad's centre or on a via)
3.3V  (via drill 0.38, 0.51)
  Top 0.254: C43.1 37.19,16.82 U1.81 30.68,16.82 v29.46,18.03 | C7.1 C48.1 30.23,32.93 30.23,29.72 30.67,29.27 U1.5 30.67,26.35 30.23,25.91 v29.46,25.91 | R23.2 R22.2 17.69,4.91 18.16,4.45 J1.1 | v29.46,21.59 29.5,21.55 31.71,21.55 32.98,22.82 U1.93 | 23.67,25.38 U1.19 23.67,30.69 22.95,31.41 C46.1 22.95,33.19 22.86,33.27 21.59,33.27 21.25,33.62 L3.1 R6.2 | 23.67,25.38 23.67,24.08 v23.88,23.88 | R24.2 28.19,8.38 29.04,9.23 C44.1 29.17,10.29 U1.68 29.17,13.5 v28.96,13.72 | R17.1 C47.1 44.03,14.64 44.62,14.06 C11.1 | U2.39 37.82,60.17 37.17,59.52 C16.1 C13.1 | 34.38,59.69 SJ3.2 | SJ3.1 SJ3.2 | SJ3.2 25.4,59.69 24.38,60.71 12.95,60.71 v11.94,59.69 13.72,57.91 R28.2 | C45.1 16.17,25.32 U1.28 23.61,25.32 23.67,25.38 | C33.1 C12.1 v9.14,26.16 8.13,27.18 3.05,27.18 2.45,26.58 R5.2 R1.2 R2.2 | JP5.VCC 9.09,36.52 v9.65,37.08 | R26.2 R25.2 v9.65,45.72 5.08,45.72 4.74,45.38 R3.2 R4.2 | v10.16,52.83 10.16,53.09 2.54,53.09 R7.2
  Top 0.406: 59.69,15.24 JP2.23 | 50.22,13.97 v48.26,13.97 47.02,13.97 | R23.2 v16.51,8.89 | C13.1 34.38,59.69 | v29.46,20.32 24.89,20.32 24.64,20.57 v23.88,20.57
  Top 0.61: 56.76,14.31 arc-90 U4.4 | 58.76,14.31 59.69,15.24 | U4.2 50.22,13.97 | v48.26,13.97 47.11,13.97 C11.1 47.02,13.97
  Bottom 0.254: v11.94,59.69 10.16,57.91 v10.16,52.83 10.16,46.23 v9.65,45.72
  Bottom 0.406: JP2.21 JP2.23 | v48.26,13.97 44.7,10.41 33.02,10.41 31.5,11.94 28.96,11.94 | v9.65,45.72 v9.65,37.08 9.65,27.43 9.14,26.92 v9.14,26.16 9.14,24.64 9.65,24.13 10.67,24.13 14.22,20.57 14.73,20.57 16.51,18.8 16.51,11.94 | 16.51,11.94 v16.51,8.89 | v29.46,25.91 v29.46,21.59 v29.46,20.32 v29.46,18.03 29.46,14.22 v28.96,13.72 28.96,11.94 | 28.96,11.94 16.51,11.94 | v23.88,20.57 v23.88,23.88
  other vias: 52.32,18.03 53.34,13.97 55.88,17.78 60.71,16.76 60.71,11.18 58.42,11.18 52.83,11.43 56.39,11.18
  pour Top: 50.29,10.16 50.29,19.3 61.47,19.3 61.47,10.16
  pour Bottom: 61.47,10.16 61.47,19.3 50.29,19.3 50.29,10.16
3.3V_A  (via drill 0.51)
  Top 0.254: C18.1 48.77,58.42 48.52,58.17 U2.18 44.19,58.17 41.19,61.17 U2.37 37.89,61.17 37.68,61.38 C14.1 36.32,61.47 34.54,61.47 C17.1 | 56.39,32.97 U3.4
  Top 0.406: C18.1 C19.1 v49.95,54.27
  Top 0.61: 56.73,33.31 U3.4 U3.2 46.99,33.02 C9.1 | R18.2 v56.73,39.79 | C19.1 50.04,55.97
  Bottom 0.406: 54.86,47.12 54.86,49.35 v49.95,54.27 | JP4.20 66.04,46.99 65.53,46.48 57.02,46.48 56.39,47.12 54.86,47.12 | v56.73,39.79 54.86,41.66 SJ2.1 SJ2.2 54.86,47.12
  pour Top: 46.99,29.46 46.99,38.1 58.42,38.1 58.42,29.46
AIN1L
  Top 0.254: JP4.13 C25.1
AIN1R
  Top 0.254: C26.1 JP4.15
AIN2L
  Top 0.254: JP4.17 C37.1
AIN2R
  Top 0.254: C38.1 JP4.19
AOUT1L
  Top 0.254: R8.2 C21.2 JP4.1
AOUT1R
  Top 0.254: R9.2 C22.2 JP4.3
AOUT2L
  Top 0.254: R10.2 C23.2 JP4.5
AOUT2R
  Top 0.254: R11.2 C24.2 JP4.7
AOUT3L
  Top 0.254: R12.2 C27.2 JP4.9
AOUT3R
  Top 0.254: R13.2 C28.2 JP4.11
APDN  (via drill 0.38)
  Top 0.254: U2.8 43.93,50.79 41.4,48.26 TP2.7 v26.92,48.26 | U1.70 30.17,13.52 v28.7,14.99
  Bottom 0.254: v28.7,14.99 28.7,26.67 27.69,27.69 27.69,47.5 v26.92,48.26
BCLK  (via drill 0.38)
  Top 0.254: U1.11 27.67,29.45 28.45,30.23 v28.96,30.23 | U2.48 42.37,55.67 v42.42,55.63
  Bottom 0.254: v42.42,55.63 42.16,55.88 42.16,56.64 41.4,57.4 41.4,58.17 40.89,58.67 39.88,58.67 39.37,58.17 34.29,58.17 33.78,58.67 33.02,58.67 32.77,58.42 TP2.3 29.21,58.42 27.94,57.15 27.94,55.63 27.43,55.12 27.43,49.78 28.7,48.51 28.7,32.26 29.46,31.5 29.46,30.73 v28.96,30.23
DBUG
  Top 0.254: U1.72 31.17,11.25 32.51,9.91 32.51,8.13 30.73,6.35 TP1.2
GND  (via drill 0.38)
  Top 0.406: SJ1.2 SJ1.1
  other vias: 53.59,70.1 53.59,67.56 53.59,65.02 53.59,62.23 53.59,59.69 57.91,57.15 57.91,59.69 57.91,62.23 57.91,64.77 57.91,67.31 57.91,69.85 57.91,54.61 57.91,52.07 50.04,66.8 50.04,64.01 45.97,64.01 46.99,62.23 45.21,67.06 49.02,57.4 17.27,17.02 17.27,20.83 12.95,20.57 11.94,17.27 14.22,17.27 17.53,12.95 19.56,12.95 17.53,10.92 21.34,10.67 33.53,11.43 35.56,11.43 15.24,12.45 15.24,8.89 16.51,5.33 17.27,2.03 25.65,2.03 12.45,0.76 7.37,0.76 6.86,19.05 9.65,18.29 0.76,7.87 32.77,0.76 38.86,5.84 39.12,0.76 43.69,0.76 47.75,0.76 53.09,0.76 30.23,35.81 35.56,30.73 35.31,33.02 34.04,28.45 39.12,34.29 42.16,37.34 46.99,39.12 52.32,39.12 45.21,34.8 45.21,32 41.4,30.73 43.18,28.7 58.42,38.86 59.44,44.2 56.39,44.2 53.09,44.2 49.28,44.2 43.69,44.2 37.08,44.2 29.97,44.2 28.7,54.36 28.7,52.32 25.15,56.13 25.15,53.09 26.42,61.21 19.3,62.74 11.94,55.37 18.29,51.56 13.72,49.78 13.97,43.43 18.29,43.18 5.33,55.63 1.02,56.13 14.48,59.44 2.54,60.96 22.35,58.17 48.26,17.53 49.53,20.83 52.32,21.59 52.32,20.32 59.69,21.59 53.09,57.15 52.07,54.1 47.24,54.1 41.4,52.32 34.8,52.32 33.53,49.28 40.64,49.28 33.02,46.74 41.15,46.74 48.01,46.74 53.34,46.74 60.96,49.53 60.96,52.07 60.96,54.61 39.37,62.23 30.99,65.28 30.73,72.9 35.56,68.07 39.62,72.9 46.74,72.9 53.85,72.9 58.42,72.9 68.58,65.53 75.44,65.53 75.44,56.9 75.44,50.29 73.15,46.48 68.83,44.2 75.44,44.2 44.96,51.05 28.7,66.29 28.7,72.9 17.78,72.9 11.68,66.55 7.62,72.9 0.76,64.52 75.44,34.54 75.44,24.13 75.44,14.73 75.44,8.64 29.97,40.13 37.08,40.13 43.69,40.13 49.28,40.13 54.86,40.39 17.02,37.85 0.76,40.13 1.52,45.21 68.07,72.9 75.44,46.48 75.44,0.76 64.26,0.76 60.71,0.76 0.76,0.76 17.27,26.67 0.76,32 0.76,25.91 4.32,30.23 3.56,36.83 3.81,46.23 12.7,38.61 14.22,35.31 13.97,33.27 17.78,29.72 11.94,31.24 7.62,31.5 8.64,29.21 10.16,22.35 8.38,10.41 9.14,5.08 69.09,32.26 69.09,23.11 69.34,11.94 6.35,46.48 7.37,41.91 6.86,38.86 35.56,6.86 32.77,4.32 37.34,3.3
  pour Top (rank 2): 0,73.66 29.21,73.66 29.21,44.72 76.2,44.72 76.2,0 0,0
  pour Top: 30.48,73.66 30.48,45.99 76.2,45.99 76.2,66.04 68.58,66.04 68.58,73.66
  pour Bottom (rank 2): 0,73.66 29.21,73.66 29.21,44.72 76.2,44.72 76.2,0 0,0
  pour Bottom: 30.48,73.66 30.48,45.99 76.2,45.99 76.2,66.04 68.58,66.04 68.58,73.66
HSDM  (via drill 0.38)
  Top 0.254: U1.94 32.72,23.32 32,22.61 20.57,22.61 v20.32,22.86 | v16,22.61 15.24,21.84 11.94,21.84 10.41,20.32 10.41,16.51 9.79,15.89 JP1.D-
  Bottom 0.254: v16,22.61 16.26,22.86 v20.32,22.86
HSDP  (via drill 0.38)
  Top 0.254: U1.95 32.46,23.82 31.75,23.11 22.1,23.11 21.84,23.37 v21.34,23.37 | JP1.D+ 9.91,15.24 10.92,16.26 10.92,20.07 12.19,21.34 15.75,21.34 v16,21.59
  Bottom 0.254: v16,21.59 16.51,22.1 20.57,22.1 21.34,22.86 v21.34,23.37
I2C_SCK  (via drill 0.38)
  Top 0.254: U2.46 40.67,56.67 v40.89,56.9 | U1.55 22.67,13.91 v22.61,13.97 | v28.19,50.29 25.65,50.29 24.89,49.53 24.89,48.51 | 24.89,48.51 24.89,46.99 R26.1 | v22.61,48.26 22.86,48.51 24.89,48.51
  Bottom 0.254: v40.89,56.9 40.64,57.15 29.21,57.15 28.45,56.39 28.45,55.37 27.94,54.86 27.94,51.05 28.19,50.8 v28.19,50.29 | v22.61,13.97 22.61,20.32 23.11,20.83 23.11,24.13 21.34,25.91 21.34,46.99 v22.61,48.26
I2C_SDA  (via drill 0.38)
  Top 0.254: v33.27,57.91 33.02,57.91 32.26,57.15 v26.92,57.15 | U2.45 39.9,57.17 v40.64,57.91 | R25.1 v26.42,45.72 | U1.64 v27.17,15.49 v27.18,15.49
  Bottom 0.254: v40.64,57.91 40.39,57.66 33.27,57.66 v33.27,57.91 | v27.18,15.49 27.18,43.69 26.16,44.7 26.16,45.72 | 26.16,45.72 26.16,48.77 26.42,49.02 26.42,56.64 v26.92,57.15 | v26.42,45.72 26.16,45.72
LRCK  (via drill 0.38)
  Top 0.254: U1.12 27.17,29.71 v28.7,31.24 | v27.18,55.88 TP2.4 33.53,54.1 39.88,54.1 39.95,54.17 U2.1
  Bottom 0.254: v28.7,31.24 28.19,31.75 28.19,48.26 26.92,49.53 26.92,55.63 v27.18,55.88
MCLK  (via drill 0.38)
  Top 0.254: U2.47 41.95,56.17 42.16,56.39 v42.16,57.66 | U1.15 25.67,29.23 v26.42,29.97
  Bottom 0.254: v26.42,29.97 26.67,30.23 26.67,43.43 25.65,44.45 25.65,49.02 25.91,49.28 25.91,57.15 26.67,57.91 27.94,57.91 30.99,60.96 TP2.2 32.26,60.96 34.54,58.67 39.12,58.67 39.62,59.18 41.15,59.18 42.16,58.17 v42.16,57.66
MIN  (via drill 0.38)
  Top 0.254: JP2.18 64.77,21.59 62.99,21.59 61.21,23.37 51.82,23.37 51.31,22.86 46.99,22.86 v46.48,22.35 | v40.64,11.94 40.39,11.68 36.83,11.68 36.09,12.42 U1.75
  Bottom 0.254: v40.64,11.94 41.4,12.7 43.43,12.7 45.97,15.24 45.97,20.57 46.48,21.08 v46.48,22.35
MOUT  (via drill 0.38)
  Top 0.254: JP2.20 64.77,19.05 62.99,19.05 61.72,20.32 61.72,22.1 60.96,22.86 52.07,22.86 51.56,22.35 47.5,22.35 46.74,21.59 45.72,21.59 v45.47,21.34 | U1.56 23.17,13.26 v23.88,13.97 | v27.94,13.97 27.94,15.24 28.45,15.75 28.96,15.75 v30.73,13.97
  Bottom 0.254: v23.88,13.97 v27.94,13.97 | v30.73,13.97 32,12.7 35.81,12.7 36.83,11.68 39.37,11.68 40.89,13.21 43.18,13.21 45.47,15.49 v45.47,21.34
N$1
  Top 0.254: C2.1 40.22,23.25 Y1.3 40.39,23.68 40.39,24.89 39.96,25.32 U1.98
N$2
  Top 0.254: C1.1 38.52,27.55 Y1.1 38.1,27.13 38.1,25.91 38.01,25.82 U1.99
N$3  (via drill 0.38)
  Top 0.254: C3.1 L1.1 33.87,36.49 v33.53,36.83 | U1.96 32.07,24.32 v31.75,24.64
  Bottom 0.254: v31.75,24.64 31.75,35.05 v33.53,36.83
N$4
  Top 0.254: U1.90 36.08,21.32 37.08,20.32 L4.2 42.33,20.37 C29.1
N$5  (via drill 0.38)
  Top 0.254: C4.1 L2.1 33.87,33.11 v33.78,33.02 | U1.86 32.75,19.32 v32.51,19.56
  Bottom 0.254: v32.51,19.56 32.26,19.81 32.26,21.08 32.51,21.34 32.51,31.75 33.4,32.64 v33.78,33.02
N$6
  Top 0.254: C15.1 37.34,55.63 37.59,55.88 37.59,58.93 37.83,59.17 U2.41
N$7  (via drill 0.38)
  Top 0.254: R15.2 10.16,14.73 v9.65,14.22 | JP1.VBUS 9.17,16.54 v9.65,17.02
  Top 0.406: R15.2 C36.1 11.85,3.9 14.48,1.27 31.75,1.27 37.71,7.23 D2.A
  Bottom 0.254: v9.65,17.02 v9.65,14.22
N$9  (via drill 0.51)
  Top 0.406: D2.C 43.3,3.05 45.47,3.05 | 45.47,3.05 45.47,7.62 48.01,10.16 48.01,11.34 C10.1 | Q1.2 47.07,3.05 45.47,3.05
  Top 0.61: C10.1 50.04,11.48 50.22,11.66 U4.3 50.24,10.72 v50.8,10.16 | C8.1 50.01,30.48 U3.3 50.24,29.77 v50.8,29.21
  Bottom 0.406: v50.8,10.16 v50.8,29.21
N$10  (via drill 0.38)
  Top 0.254: U1.31 14.93,23.82 v14.22,23.11 | v12.7,53.59 1.78,53.59 1.02,52.83 1.02,52.58 1.27,52.58 D1.C
  Bottom 0.254: v14.22,23.11 13.72,23.11 10.67,26.16 10.67,33.78 11.18,34.29 11.18,35.31 10.41,36.07 10.41,37.34 10.16,37.59 10.16,44.96 12.7,47.5 v12.7,53.59
N$11
  Top 0.254: 1.27,50.8 D1.A 2.51,50.94 R7.1
N$12
  Top 0.254: C20.1 49.02,59.69 48.5,59.17 U2.20
N$13
  Top 0.254: U2.36 40.43,67.1 44.45,71.12 C21.1
N$14  (via drill 0.38)
  Top 0.254: U2.12 45.93,52.88 46.23,52.58 v46.74,52.58 | C26.2 53.85,53.34 53.59,53.09 53.59,51.31 53.09,50.8 50.8,50.8 v50.29,50.29
  Bottom 0.254: v50.29,50.29 49.02,50.29 v46.74,52.58
N$15
  Top 0.254: U2.10 44.93,52.61 46.23,51.31 52.83,51.31 53.09,51.56 53.09,53.34 53.59,53.85 53.59,55.37 54.1,55.88 C25.2
N$16  (via drill 0.38)
  Top 0.254: C34.1 R14.2 v41.4,25.4 | U1.97 36.65,24.82 v36.83,24.64
  Bottom 0.254: v41.4,25.4 40.64,24.64 v36.83,24.64
N$17  (via drill 0.38)
  Top 0.254: L3.2 C35.1 23.11,35.56 v23.11,37.08 | U1.9 28.67,24.86 27.94,24.13 25.65,24.13 v24.89,24.89
  Bottom 0.254: v24.89,24.89 23.62,26.16 23.62,30.73 22.86,31.5 22.86,36.83 v23.11,37.08
N$18
  Top 0.254: C22.1 53.85,68.58 51.82,70.61 44.7,70.61 40.93,66.84 U2.35
N$19
  Top 0.254: C23.1 53.59,66.04 52.58,67.06 52.58,69.09 51.56,70.1 44.96,70.1 41.43,66.58 U2.34
N$20
  Top 0.254: C24.1 53.34,63.5 52.07,64.77 52.07,68.83 51.31,69.6 45.21,69.6 41.93,66.31 U2.33
N$21
  Top 0.254: C27.1 53.34,60.96 51.56,62.74 51.56,68.58 51.05,69.09 45.47,69.09 42.43,66.05 U2.32
N$22
  Top 0.254: C28.1 53.59,58.42 52.83,59.18 52.83,60.71 51.05,62.48 51.05,68.33 50.8,68.58 45.72,68.58 42.93,65.79 U2.31
N$23  (via drill 0.38)
  Top 0.254: v48.51,52.83 48.51,55.37 48.22,55.67 U2.13 | C37.2 53.85,50.8 53.09,50.04 v51.56,50.04
  Bottom 0.254: 51.82,50.04 v51.56,50.04 48.77,52.83 v48.51,52.83
N$24
  Top 0.254: L4.1 44.2,20.32 44.2,19.3 43.94,19.05 42.67,19.05 42.42,18.8 42.42,17.78 R17.2
N$25
  Top 0.61: R18.1 R20.2 50.38,35.47 U3.1
N$26
  Top 0.254: R27.1 16.26,56.64 | 16.26,56.64 10.67,56.64 7.87,59.44 3.56,59.44 2.58,58.46 S2.2 | S1.3 16.38,56.52 16.26,56.64
N$27  (via drill 0.38)
  Top 0.254: U2.15 48.74,56.67 49.02,56.39 49.02,53.59 v50.04,52.58 | C38.2 v53.85,48.26
  Bottom 0.254: v50.04,52.58 50.55,52.58 53.85,49.28 v53.85,48.26
N$28
  Top 0.254: U2.23 48.22,60.67 J7.P$1
N$29
  Top 0.61: R19.1 R21.2 50.41,16.45 U4.1
N$30
  Top 0.254: U2.21 48.24,59.67 49.78,61.21 J8.P$1
N$31
  Top 0.254: J3.P$1 43.43,65.02 U2.30
N$32
  Top 0.254: U2.29 43.93,64.5 J4.P$1
N$33
  Top 0.254: U2.28 44.43,64.24 45.47,65.28 45.72,65.28 J5.P$1
N$34
  Top 0.254: U2.27 44.93,63.98 45.72,64.77 46.23,64.77 J6.P$1
N$35
  Top 0.254: U1.14 26.17,26.15 26.92,25.4 J12.P$1
N$36
  Top 0.254: U1.13 26.67,26.67 26.92,26.42 J13.P$1
N$75
  Top 0.254: 47.26,7.47 Q1.1
  Top 0.406: R29.2 47.26,7.47
NRESET  (via drill 0.38)
  Top 0.254: v15.24,2.79 25.15,2.79 25.65,3.3 25.65,5.08 25.02,5.71 J1.10 24.13,8.22 R24.1 | 24.13,8.55 R24.1 | U1.58 24.17,8.51 R24.1 | C30.1 R28.1 R27.2 20.83,56.64 21.84,55.63 21.84,51.56 21.08,50.8 v5.59,50.8
  Bottom 0.254: v5.59,50.8 5.08,50.29 5.08,20.83 6.1,19.81 6.1,9.4 12.7,2.79 v15.24,2.79
RXD  (via drill 0.38)
  Top 0.254: JP2.17 62.48,22.86 61.47,23.88 51.56,23.88 51.05,23.37 46.74,23.37 46.48,23.11 v45.72,23.11 | U1.51 20.67,13.56 21.84,14.73 v25.4,14.73 | v27.94,16.51 29.21,16.51 32,13.72 33.53,13.72 34.29,12.95 36.32,12.95 37.08,12.19 38.86,12.19 v40.13,13.46
  Bottom 0.254: v25.4,14.73 27.43,14.73 27.94,15.24 v27.94,16.51 | v40.13,13.46 40.39,13.72 42.93,13.72 44.96,15.75 44.96,19.3 44.7,19.56 44.7,22.1 v45.72,23.11
SDCD  (via drill 0.38)
  Top 0.254: U1.49 15.91,14.82 v15.49,15.24 | v6.35,28.45 12.32,34.41 JP5.CD2 | 15.75,34.8 16,34.54 15.99,34.54 JP5.CD2 | R6.1 15.98,34.29 JP5.CD2 | JP5.CD1 JP5.CD2
  Bottom 0.254: v15.49,15.24 12.95,12.7 10.16,12.7 8.89,13.97 8.89,19.81 6.6,22.1 6.6,23.88 6.1,24.38 6.1,28.19 v6.35,28.45
SDCLK  (via drill 0.38)
  Top 0.254: U1.40 16.78,19.32 16.51,19.05 v13.21,19.05 | JP5.CLK 5.59,37.59 7.62,37.59 v7.87,37.34 | v9.4,46.74 9.91,46.74 TP3.4
  Bottom 0.254: v13.21,19.05 11.18,19.05 7.62,22.61 7.62,24.13 7.87,24.38 7.87,24.89 7.37,25.4 7.11,25.4 7.11,27.43 7.62,27.94 7.62,28.96 6.6,29.97 6.6,32 7.11,32.51 7.62,32.51 8.13,33.02 8.13,34.29 8.64,34.29 8.64,36.58 v7.87,37.34 8.89,38.35 8.89,46.23 v9.4,46.74
SDCMD  (via drill 0.38)
  Top 0.254: U1.79 33.71,15.82 33.27,16.26 30.48,16.26 29.72,17.02 28.96,17.02 28.7,17.27 27.69,17.27 25.91,15.49 24.89,15.49 24.64,15.24 v21.34,15.24 | R5.1 7.11,25.91 7.87,25.15 v10.16,25.15 | v10.41,34.8 8.64,34.8 v7.87,35.56 7.74,35.42 JP5.CMD
  Bottom 0.254: v21.34,15.24 20.83,15.24 14.99,21.08 14.48,21.08 10.92,24.64 10.67,24.64 v10.16,25.15 10.16,34.54 v10.41,34.8 | v7.87,35.56 7.87,36.07 7.11,36.83 7.11,37.85 8.38,39.12 8.38,47.75 TP3.3
SDD0  (via drill 0.38)
  Top 0.254: U1.82 32.72,17.32 30.99,19.05 25.4,19.05 24.38,18.03 v21.34,18.03 | JP5.DAT0 10.72,39.82 v10.92,39.62 | R3.1 7.37,44.45 v7.62,44.7 10.67,44.7 v10.92,44.45
  Bottom 0.254: v21.34,18.03 21.34,18.54 21.08,18.8 21.08,19.3 21.34,19.56 21.34,20.57 22.1,21.34 22.1,23.62 18.8,26.92 18.03,26.92 11.68,33.27 11.68,35.56 10.92,36.32 10.92,37.59 10.67,37.85 10.67,39.37 v10.92,39.62 10.67,39.62 10.67,44.2 v10.92,44.45 | TP3.2 6.6,48.26 6.6,48.01 7.87,46.74 7.87,44.96 v7.62,44.7
SDD1  (via drill 0.38)
  Top 0.254: U1.83 33.06,17.82 31.32,19.56 25.15,19.56 24.38,18.8 23.88,18.8 23.62,19.05 v21.84,19.05 | JP5.DAT1 11.65,40.92 v11.68,40.89 | v11.43,43.18 R4.1
  Bottom 0.254: v21.84,19.05 21.84,20.32 22.61,21.08 22.61,23.88 19.05,27.43 18.29,27.43 12.19,33.53 12.19,35.81 11.43,36.58 11.43,38.86 11.68,39.12 v11.68,40.89 11.18,41.4 11.18,42.93 v11.43,43.18
SDD2  (via drill 0.38)
  Top 0.254: U1.42 15.53,18.32 v15.49,18.29 | v7.11,24.64 R1.1 | JP5.DAT2 7.06,33.22 v7.11,33.27
  Bottom 0.254: v15.49,18.29 11.18,18.29 7.11,22.35 v7.11,24.64 6.6,25.15 6.6,27.69 7.11,28.19 7.11,28.7 6.1,29.72 6.1,32.26 v7.11,33.27
SDD3  (via drill 0.38)
  Top 0.254: U1.50 15.59,14.32 v15.49,14.22 | R2.1 v5.84,23.37 | JP5.CD/DAT3 7.33,34.32 v7.37,34.29
  Bottom 0.254: v15.49,14.22 13.46,12.19 9.91,12.19 8.38,13.72 8.38,19.56 5.84,22.1 v5.84,23.37 5.84,23.88 5.59,24.13 5.59,32.77 7.11,34.29 v7.37,34.29
SWCLK/TCK  (via drill 0.38)
  Top 0.254: J1.4 20.32,6.35 20.57,6.6 | 20.57,6.6 22.1,6.6 22.35,6.86 22.35,10.41 v22.86,10.92 | 20.57,6.6 20.57,8.64 20.32,8.89 R23.1 | U1.63 26.67,11.43 26.16,10.92 v25.15,10.92
  Bottom 0.254: v25.15,10.92 v22.86,10.92
SWDIO/TMS  (via drill 0.38)
  Top 0.254: J1.2 19.05,6.35 19.39,6.69 R22.1 | U1.57 23.67,10.46 23.11,9.91 v23.11,9.14
  Bottom 0.254: v23.11,9.14 21.08,7.11 20.45,7.11 J1.2
TDI  (via drill 0.38)
  Top 0.254: v33.02,7.62 33.02,10.16 32.17,11.01 U1.74
  Bottom 0.254: v33.02,7.62 23.37,7.62 22.86,7.11 J1.8
TDMI  (via drill 0.38)
  Top 0.254: U2.42 42.17,58.67 v43.69,57.15 | U1.46 19.88,16.32 20.57,17.02 25.4,17.02 v26.16,17.78 | TP2.6 29.97,50.8 29.72,51.05 v25.15,51.05
  Bottom 0.254: v43.69,57.15 43.69,50.55 43.43,50.29 42.42,50.29 42.16,50.55 33.78,50.55 33.53,50.8 TP2.6 | v26.16,17.78 26.16,20.57 26.67,21.08 26.67,24.89 24.64,26.92 24.64,50.55 v25.15,51.05
TDMO  (via drill 0.38, 0.51)
  Top 0.254: U2.7 43.43,51.56 v42.93,51.05 | U1.36 25.64,21.32 v25.91,21.59 | TP2.5 29.97,51.56 26.16,51.56 25.65,52.07 v24.89,52.07
  Bottom 0.254: v42.93,51.05 34.04,51.05 TP2.5 | v25.91,21.59 26.16,21.59 26.16,24.64 24.13,26.67 24.13,51.31 v24.89,52.07
TDO  (via drill 0.38)
  Top 0.254: U1.77 33.44,14.82 v33.02,15.24 | v40.64,15.49 41.4,14.73 41.4,10.16 40.13,8.89 34.8,8.89 v34.54,8.64
  Bottom 0.254: J1.6 21.59,6.86 22.86,8.13 32.26,8.13 33.02,8.89 34.29,8.89 v34.54,8.64 | v33.02,15.24 34.04,14.22 38.61,14.22 39.88,15.49 v40.64,15.49
TXD  (via drill 0.38)
  Top 0.254: v61.72,39.37 59.94,41.15 26.67,41.15 26.16,40.64 25.65,40.64 24.64,41.66 23.11,41.66 21.08,39.62 19.05,39.62 v18.8,39.37 | U1.23 21.67,27.26 21.34,26.92 20.57,26.92 v19.3,28.19
  Bottom 0.254: JP2.19 64.77,21.59 66.55,21.59 67.31,22.35 67.31,38.61 66.55,39.37 v61.72,39.37 | v19.3,28.19 19.3,38.86 v18.8,39.37
UIA0  (via drill 0.38)
  Top 0.203: JP2.1 26.42,43.18
  Top 0.254: 26.42,43.18 26.16,43.43 v25.4,43.43 | U1.17 24.67,30.77 v25.4,31.5
  Bottom 0.254: v25.4,31.5 25.15,31.75 25.15,43.18 v25.4,43.43
UIA1  (via drill 0.38)
  Top 0.254: JP2.2 65.79,43.18 65.79,42.93 64.77,41.91 62.99,41.91 62.23,42.67 22.86,42.67 v22.61,42.93 | U1.20 23.17,30.17 v22.86,30.48
  Bottom 0.254: v22.86,30.48 22.35,30.99 22.35,40.89 23.11,41.66 23.11,42.42 v22.61,42.93
UIA2  (via drill 0.38)
  Top 0.254: JP2.3 61.98,42.16 22.61,42.16 v22.35,41.91 | U1.21 22.67,27.11 v22.86,26.92
  Bottom 0.254: v22.86,26.92 21.84,27.94 21.84,41.4 v22.35,41.91
UIA3  (via drill 0.38)
  Top 0.254: JP2.4 65.79,40.64 65.79,40.39 64.77,39.37 62.99,39.37 60.71,41.66 26.16,41.66 v25.91,41.4 | U1.16 25.17,30 v25.65,30.48
  Bottom 0.254: v25.65,30.48 26.16,30.99 26.16,31.75 25.65,32.26 25.65,41.15 v25.91,41.4
UID0  (via drill 0.38)
  Top 0.254: U1.1 32.67,29.37 32.77,29.46 v35.31,29.46
  Bottom 0.254: JP2.5 61.21,38.1 60.71,38.61 59.44,38.61 58.93,38.1 44.45,38.1 35.81,29.46 v35.31,29.46
UID1  (via drill 0.38)
  Top 0.254: U1.92 35.78,22.32 36.07,22.61 v36.07,23.11
  Bottom 0.254: JP2.6 65.28,38.1 64.01,36.83 62.99,36.83 62.74,37.08 44.96,37.08 35.81,27.94 35.81,25.4 35.56,25.15 35.56,24.13 36.07,23.62 v36.07,23.11
UID2  (via drill 0.38)
  Top 0.254: v36.83,22.35 36.3,21.82 U1.91
  Bottom 0.254: JP2.7 62.48,36.58 45.21,36.58 36.32,27.69 36.32,25.15 36.07,24.89 36.07,24.38 36.83,23.62 v36.83,22.35
UID3  (via drill 0.38)
  Top 0.254: U1.89 v33.03,20.82 v33.02,20.83 | JP2.8 65.79,35.56 65.79,35.81 64.77,36.83 62.99,36.83 62.23,37.59 60.2,37.59 v59.94,37.85
  Bottom 0.254: v33.02,20.83 33.02,25.91 44.7,37.59 59.69,37.59 v59.94,37.85
UID4  (via drill 0.38)
  Top 0.254: U1.88 v36.07,20.32 | JP2.9 58.42,27.94 50.04,27.94 49.02,28.96 v45.97,28.96
  Bottom 0.254: v36.07,20.32 36.58,20.83 37.85,20.83 v45.97,28.96
UID5  (via drill 0.38)
  Top 0.254: JP2.10 64.77,31.75 62.99,31.75 58.67,27.43 49.78,27.43 48.77,28.45 46.99,28.45 v46.74,28.19 | v36.83,19.56 35.81,19.56 35.55,19.82 U1.87
  Bottom 0.254: v36.83,19.56 37.59,20.32 38.1,20.32 45.72,27.94 46.48,27.94 v46.74,28.19
UID6  (via drill 0.38)
  Top 0.254: JP2.11 59.94,26.92 49.53,26.92 48.77,27.69 v48.51,27.69 | U1.85 36.04,18.82 v36.07,18.8
  Bottom 0.254: v36.07,18.8 37.08,18.8 38.1,19.81 38.35,19.81 45.97,27.43 47.75,27.43 48.01,27.69 v48.51,27.69
UID7  (via drill 0.38)
  Top 0.254: JP2.12 64.77,29.21 62.99,29.21 60.2,26.42 49.28,26.42 49.02,26.67 v48.77,26.67 | v38.35,19.05 37.59,18.29 36.58,18.29 36.32,18.03 35.81,18.03 35.53,18.32 U1.84
  Bottom 0.254: v38.35,19.05 46.23,26.92 48.51,26.92 v48.77,26.67
UID8  (via drill 0.38)
  Top 0.254: JP2.13 62.48,27.94 60.45,25.91 49.02,25.91 v48.77,25.65 | U1.80 35.75,16.32 v36.07,16
  Bottom 0.254: v36.07,16 36.32,16 46.74,26.42 48.01,26.42 v48.77,25.65
UID9  (via drill 0.38)
  Top 0.254: JP2.14 64.77,26.67 61.98,26.67 60.71,25.4 49.53,25.4 49.02,24.89 48.01,24.89 v47.24,25.65 | U1.78 36.91,15.32 v37.08,15.49
  Bottom 0.254: v37.08,15.49 37.08,16 46.74,25.65 v47.24,25.65
UID10  (via drill 0.38)
  Top 0.254: JP2.15 61.47,25.4 60.96,24.89 49.78,24.89 49.28,24.38 47.75,24.38 v47.5,24.13 | U1.71 30.67,10.48 v30.73,10.41 | v43.43,11.94 43.43,9.91 43.18,9.91 v42.93,9.65
  Bottom 0.254: v42.93,9.65 42.67,9.91 32.77,9.91 32.26,10.41 v30.73,10.41 | v43.43,11.94 46.48,14.99 46.48,20.32 47.5,21.34 v47.5,24.13
UID11  (via drill 0.38)
  Top 0.254: JP2.16 64.77,24.13 62.99,24.13 62.74,24.38 51.31,24.38 51.05,24.13 v50.04,24.13 | U1.69 29.67,11.22 29.97,10.92 29.97,9.65 v30.23,9.4 | v44.96,12.45 43.94,11.43 v43.94,9.4
  Bottom 0.254: v30.23,9.4 42.16,9.4 42.67,8.89 43.43,8.89 v43.94,9.4 | v44.96,12.45 44.96,12.7 46.99,14.73 46.99,20.07 50.04,23.11 v50.04,24.13
VBDET
  Top 0.254: R15.1 R16.2 16.26,16 16.44,15.82 U1.47
VDDOUT  (via drill 0.38)
  Top 0.254: U1.76 37.15,14.32 C42.1 37.34,14.22 v37.34,12.95 | C39.1 24.17,32.39 U1.18 24.17,24.6 v24.89,23.88 25.15,23.62 29.46,23.62 v30.23,24.38 31.17,25.33 U1.4 31.17,30.41 31.24,30.48 C5.1 C6.1 L2.2 L1.2 | C40.1 22.1,30.48 22.17,30.41 U1.22 v22.17,26.09 | C41.1 17.02,20.07 17.27,19.81 U1.39 23.11,19.82 23.37,19.56 v24.13,19.56
  Bottom 0.254: v30.23,24.38 30.23,16 32.51,13.72 36.58,13.72 v37.34,12.95 | v24.13,19.56 24.89,20.32 v24.89,23.88 22.68,26.09 v22.17,26.09
VIN
  Top 0.61: Q1.3 53.93,8.38 J11.P$1 | 58.04,8.38 J11.P$1 | J2.PWR 58.29,8.38 J11.P$1
  Bottom 0.61: JP2.22 JP2.24 71.12,15.24 73.66,12.7 73.66,2.54 72.39,1.27 65.4,1.27 J2.PWR

### Text on the board
Bottom: V01
tPlace: 1L | Tapestry | 1R | Polyphonic WAV Player | 2L | AUDIO OUT | AGND | 2R | MCLK | 3L | AGND | BCLK | 3R | LRCK | 1L | STATUS | TDMO | 1R | AUDIO IN | TDMI | 2L | GND | SDD0 | SDCMD | SDCLK | APDN | 2R | 3.3V_A | RESET | A0 | A1 | A2 | A3 | robertsonics | 0 | 1 | 2 | 3 | 4 | 5 | DIGITAL IN | DIGITAL IN | 6 | 7 | 8 | 9 | 10 | 11 | RXD | IN | MIDI | TXD | OUT | 3.3V | VIN | 3.3V | VIN | GND | GND | DBUG | VIN 5-15 / VDC | SDI/JTAG
bPlace: 1L | Tapestry | 1R | Polyphonic WAV Player | 2L | AUDIO OUT | 2R | 3L | AGND | 3R | 1L | 1R | AUDIO IN | 2L | 2R | 3.3V_A | A0 | A1 | A2 | A3 | robertsonics | 0 | 1 | 2 | 3 | 4 | 5 | DIGITAL IN | DIGITAL IN | 6 | 7 | 8 | 9 | 10 | 11 | RXD | IN | MIDI | TXD | OUT | 3.3V | VIN | 3.3V | VIN | GND | GND | VIN 5-15 / VDC
Measures: 4x 0.130" holes, to clear 4-40 screws. | All dimensions in inches.
tDocu: Jamie Robertson & Byron Jacquot